# Altium project CONTROLLER.PrjPcb (part 1 of 2)
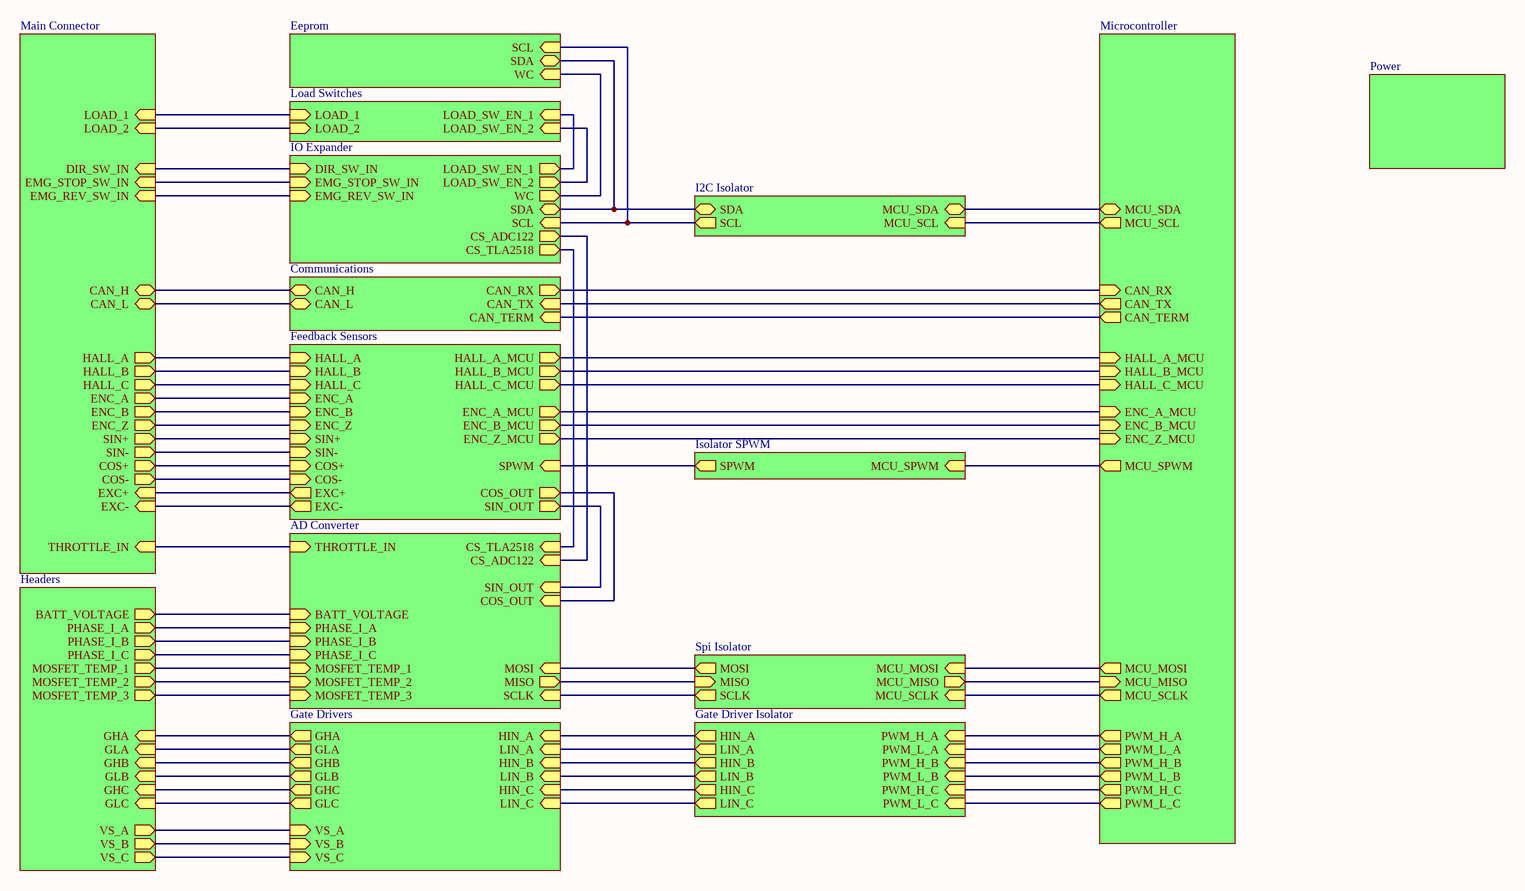
[diagram p0: Interconnections.SchDoc]
16 sheets, 214 parts. Net scope: hierarchical (ports join the sheet entries above them; power ports are global).
Board file: CONTROLLER.PcbDoc
Sheets:
  Interconnections.SchDoc
    Power = Power.SchDoc
    Eeprom = Eeprom.SchDoc
    Load Switches = Load_Switches.SchDoc
    IO Expander = IO_Expander.SchDoc
    Communications = Communications.SchDoc
    Feedback Sensors = Feedback_Sensors.SchDoc
    AD Converter = AD_Converter.SchDoc
    Gate Drivers = Gate_Drivers.SchDoc
    Gate Driver Isolator = Isolator_Gate_Driver.SchDoc
    Headers = Headers.SchDoc
    Main Connector = Main_Connector.SchDoc
    Microcontroller = Microcontroller.SchDoc
    Spi Isolator = Isolator_Spi.SchDoc
    I2C Isolator = Isolator_I2C.SchDoc
    Isolator SPWM = Isolator_SPWM.SchDoc

## Sheet Interconnections.SchDoc
size A3; SheetNumber: 1; SheetTotal: 16

### Sub-sheets
AD Converter = AD_Converter.SchDoc: CS_TLA2518 (in), BATT_VOLTAGE (in), PHASE_I_A (in), PHASE_I_C (in), MOSFET_TEMP_1 (in), MOSFET_TEMP_2 (in), MOSFET_TEMP_3 (in), SIN_OUT (in), COS_OUT (in), CS_ADC122 (in), THROTTLE_IN (in), PHASE_I_B (in), SCLK (in), MISO (out), MOSI (in)
Communications = Communications.SchDoc: CAN_RX (out), CAN_TX (in), CAN_H (bidir), CAN_L (bidir), CAN_TERM (in)
Eeprom = Eeprom.SchDoc: SCL (in), SDA (bidir), WC (in)
Feedback Sensors = Feedback_Sensors.SchDoc: EXC- (out), SPWM (in), EXC+ (out), SIN+ (in), SIN- (in), SIN_OUT (out), COS+ (in), COS- (in), HALL_A (in), HALL_B (in), HALL_C (in), HALL_A_MCU (out), HALL_B_MCU (out), HALL_C_MCU (out), ENC_A (in), ENC_B (in), ENC_A_MCU (out), ENC_B_MCU (out), ENC_Z_MCU (out), ENC_Z (in), COS_OUT (out)
Gate Driver Isolator = Isolator_Gate_Driver.SchDoc: PWM_H_A (in), PWM_L_A (in), PWM_H_B (in), PWM_L_B (in), PWM_H_C (in), PWM_L_C (in), HIN_A (out), LIN_A (out), HIN_B (out), LIN_B (out), HIN_C (out), LIN_C (out)
Gate Drivers = Gate_Drivers.SchDoc: GHA (out), GLA (out), VS_A (in), HIN_A (in), LIN_A (in), GHB (out), GLB (out), VS_B (in), HIN_B (in), LIN_B (in), GHC (out), GLC (out), VS_C (in), HIN_C (in), LIN_C (in)
Headers = Headers.SchDoc: MOSFET_TEMP_3 (out), MOSFET_TEMP_1 (out), PHASE_I_C (out), PHASE_I_A (out), BATT_VOLTAGE (out), MOSFET_TEMP_2 (out), VS_A (out), VS_B (out), VS_C (out), GHA (in), GLA (in), GHB (in), GLB (in), GHC (in), GLC (in), PHASE_I_B (out)
I2C Isolator = Isolator_I2C.SchDoc: MCU_SDA (bidir), MCU_SCL (in), SDA (bidir), SCL (out)
IO Expander = IO_Expander.SchDoc: LOAD_SW_EN_1 (out), LOAD_SW_EN_2 (out), CS_TLA2518 (out), DIR_SW_IN (in), EMG_STOP_SW_IN (in), EMG_REV_SW_IN (in), CS_ADC122 (out), WC (out), SDA (bidir), SCL (in)
Isolator SPWM = Isolator_SPWM.SchDoc: MCU_SPWM (in), SPWM (out)
Load Switches = Load_Switches.SchDoc: LOAD_SW_EN_1 (in), LOAD_1 (in), LOAD_SW_EN_2 (in), LOAD_2 (in)
Main Connector = Main_Connector.SchDoc: LOAD_1 (in), LOAD_2 (in), DIR_SW_IN (in), EMG_STOP_SW_IN (in), EMG_REV_SW_IN (in), THROTTLE_IN (in), CAN_H (bidir), CAN_L (bidir), EXC+ (in), HALL_A (out), HALL_B (out), HALL_C (out), ENC_A (out), ENC_B (out), ENC_Z (out), SIN+ (out), SIN- (out), COS+ (out), COS- (out), EXC- (in)
Microcontroller = Microcontroller.SchDoc: ENC_Z_MCU (in), ENC_B_MCU (in), ENC_A_MCU (in), HALL_C_MCU (in), HALL_B_MCU (in), HALL_A_MCU (in), CAN_TERM (out), CAN_TX (out), CAN_RX (in), MCU_MOSI (out), MCU_MISO (in), MCU_SCLK (out), PWM_H_A (out), PWM_L_A (out), PWM_L_B (out), PWM_L_C (out), PWM_H_B (out), PWM_H_C (out), MCU_SDA (bidir), MCU_SCL (out), MCU_SPWM (out)
Power = Power.SchDoc: no entries
Spi Isolator = Isolator_Spi.SchDoc: MCU_SCLK (in), MCU_MOSI (in), MCU_MISO (out), SCLK (out), MOSI (out), MISO (in)

### Nets
MISO: sheet AD Converter/MISO, sheet Spi Isolator/MISO
MOSI: sheet AD Converter/MOSI, sheet Spi Isolator/MOSI
SCLK: sheet AD Converter/SCLK, sheet Spi Isolator/SCLK
NetC31_1: sheet IO Expander/DIR_SW_IN, sheet Main Connector/DIR_SW_IN
NetC32_1: sheet IO Expander/EMG_STOP_SW_IN, sheet Main Connector/EMG_STOP_SW_IN
NetC33_1: sheet IO Expander/EMG_REV_SW_IN, sheet Main Connector/EMG_REV_SW_IN
NetC38_1: sheet Feedback Sensors/EXC-, sheet Main Connector/EXC-
NetC39_1: sheet Feedback Sensors/SPWM, sheet Isolator SPWM/SPWM
NetC45_1: sheet Feedback Sensors/EXC+, sheet Main Connector/EXC+
NetC53_1: sheet Feedback Sensors/SIN_OUT, sheet AD Converter/SIN_OUT
NetC55_1: sheet Feedback Sensors/COS_OUT, sheet AD Converter/COS_OUT
NetC74_1: sheet Gate Drivers/VS_A, sheet Headers/VS_A
NetC75_1: sheet Gate Drivers/VS_B, sheet Headers/VS_B
NetC76_1: sheet Gate Drivers/VS_C, sheet Headers/VS_C
NetD2_2: sheet Load Switches/LOAD_1, sheet Main Connector/LOAD_1
NetD4_2: sheet Load Switches/LOAD_2, sheet Main Connector/LOAD_2
NetD9_1: sheet Communications/CAN_H, sheet Main Connector/CAN_H
NetD9_2: sheet Communications/CAN_L, sheet Main Connector/CAN_L
NetD12_1: sheet AD Converter/THROTTLE_IN, sheet Main Connector/THROTTLE_IN
NetIC2_5: sheet Eeprom/SDA, sheet IO Expander/SDA, sheet I2C Isolator/SDA
NetIC2_6: sheet Eeprom/SCL, sheet IO Expander/SCL, sheet I2C Isolator/SCL
NetIC2_7: sheet Eeprom/WC, sheet IO Expander/WC
NetIC3_5: sheet Load Switches/LOAD_SW_EN_1, sheet IO Expander/LOAD_SW_EN_1
NetIC3_7: sheet Load Switches/LOAD_SW_EN_2, sheet IO Expander/LOAD_SW_EN_2
NetIC3_8: sheet IO Expander/CS_TLA2518, sheet AD Converter/CS_TLA2518
NetIC3_10: sheet IO Expander/CS_ADC122, sheet AD Converter/CS_ADC122
NetIC4_2: sheet Communications/CAN_RX, sheet Microcontroller/CAN_RX
NetIC4_3: sheet Communications/CAN_TX, sheet Microcontroller/CAN_TX
NetIC6_3: sheet Feedback Sensors/HALL_A, sheet Main Connector/HALL_A
NetIC6_4: sheet Feedback Sensors/HALL_B, sheet Main Connector/HALL_B
NetIC6_5: sheet Feedback Sensors/HALL_C, sheet Main Connector/HALL_C
NetIC6_12: sheet Feedback Sensors/HALL_C_MCU, sheet Microcontroller/HALL_C_MCU
NetIC6_13: sheet Feedback Sensors/HALL_B_MCU, sheet Microcontroller/HALL_B_MCU
NetIC6_14: sheet Feedback Sensors/HALL_A_MCU, sheet Microcontroller/HALL_A_MCU
NetIC8_3: sheet Feedback Sensors/ENC_A, sheet Main Connector/ENC_A
NetIC8_4: sheet Feedback Sensors/ENC_B, sheet Main Connector/ENC_B
NetIC8_5: sheet Feedback Sensors/ENC_Z, sheet Main Connector/ENC_Z
NetIC8_12: sheet Feedback Sensors/ENC_Z_MCU, sheet Microcontroller/ENC_Z_MCU
NetIC8_13: sheet Feedback Sensors/ENC_B_MCU, sheet Microcontroller/ENC_B_MCU
NetIC8_14: sheet Feedback Sensors/ENC_A_MCU, sheet Microcontroller/ENC_A_MCU
NetIC11_1: sheet AD Converter/PHASE_I_A, sheet Headers/PHASE_I_A
NetIC11_2: sheet AD Converter/PHASE_I_B, sheet Headers/PHASE_I_B
NetIC11_3: sheet AD Converter/PHASE_I_C, sheet Headers/PHASE_I_C
NetIC11_4: sheet AD Converter/MOSFET_TEMP_1, sheet Headers/MOSFET_TEMP_1
NetIC11_5: sheet AD Converter/MOSFET_TEMP_2, sheet Headers/MOSFET_TEMP_2
NetIC11_6: sheet AD Converter/MOSFET_TEMP_3, sheet Headers/MOSFET_TEMP_3
NetIC11_16: sheet AD Converter/BATT_VOLTAGE, sheet Headers/BATT_VOLTAGE
NetIC13_1: sheet Gate Drivers/GLA, sheet Headers/GLA
NetIC13_8: sheet Gate Drivers/GHA, sheet Headers/GHA
NetIC13_12: sheet Gate Drivers/HIN_A, sheet Gate Driver Isolator/HIN_A
NetIC13_14: sheet Gate Drivers/LIN_A, sheet Gate Driver Isolator/LIN_A
NetIC14_1: sheet Gate Drivers/GLB, sheet Headers/GLB
NetIC14_8: sheet Gate Drivers/GHB, sheet Headers/GHB
NetIC14_12: sheet Gate Drivers/HIN_B, sheet Gate Driver Isolator/HIN_B
NetIC14_14: sheet Gate Drivers/LIN_B, sheet Gate Driver Isolator/LIN_B
NetIC15_1: sheet Gate Drivers/GLC, sheet Headers/GLC
NetIC15_8: sheet Gate Drivers/GHC, sheet Headers/GHC
NetIC15_12: sheet Gate Drivers/HIN_C, sheet Gate Driver Isolator/HIN_C
NetIC15_14: sheet Gate Drivers/LIN_C, sheet Gate Driver Isolator/LIN_C
NetIC16_2: sheet Gate Driver Isolator/PWM_H_A, sheet Microcontroller/PWM_H_A
NetIC16_3: sheet Gate Driver Isolator/PWM_L_A, sheet Microcontroller/PWM_L_A
NetIC16_4: sheet Gate Driver Isolator/PWM_H_B, sheet Microcontroller/PWM_H_B
NetIC16_5: sheet Gate Driver Isolator/PWM_L_B, sheet Microcontroller/PWM_L_B
NetIC16_6: sheet Gate Driver Isolator/PWM_H_C, sheet Microcontroller/PWM_H_C
NetIC16_7: sheet Gate Driver Isolator/PWM_L_C, sheet Microcontroller/PWM_L_C
NetIC17_15: sheet Microcontroller/MCU_SCL, sheet I2C Isolator/MCU_SCL
NetIC17_16: sheet Microcontroller/MCU_SDA, sheet I2C Isolator/MCU_SDA
NetIC17_17: sheet Communications/CAN_TERM, sheet Microcontroller/CAN_TERM
NetIC17_45: sheet Microcontroller/MCU_SPWM, sheet Isolator SPWM/MCU_SPWM
NetIC17_46: sheet Microcontroller/MCU_SCLK, sheet Spi Isolator/MCU_SCLK
NetIC17_49: sheet Microcontroller/MCU_MISO, sheet Spi Isolator/MCU_MISO
NetIC17_50: sheet Microcontroller/MCU_MOSI, sheet Spi Isolator/MCU_MOSI
NetJ5_28: sheet Feedback Sensors/SIN+, sheet Main Connector/SIN+
NetJ5_29: sheet Feedback Sensors/SIN-, sheet Main Connector/SIN-
NetJ5_30: sheet Feedback Sensors/COS+, sheet Main Connector/COS+
NetJ5_31: sheet Feedback Sensors/COS-, sheet Main Connector/COS-

## Sheet Power.SchDoc
size A3; SheetNumber: 2; SheetTotal: 16
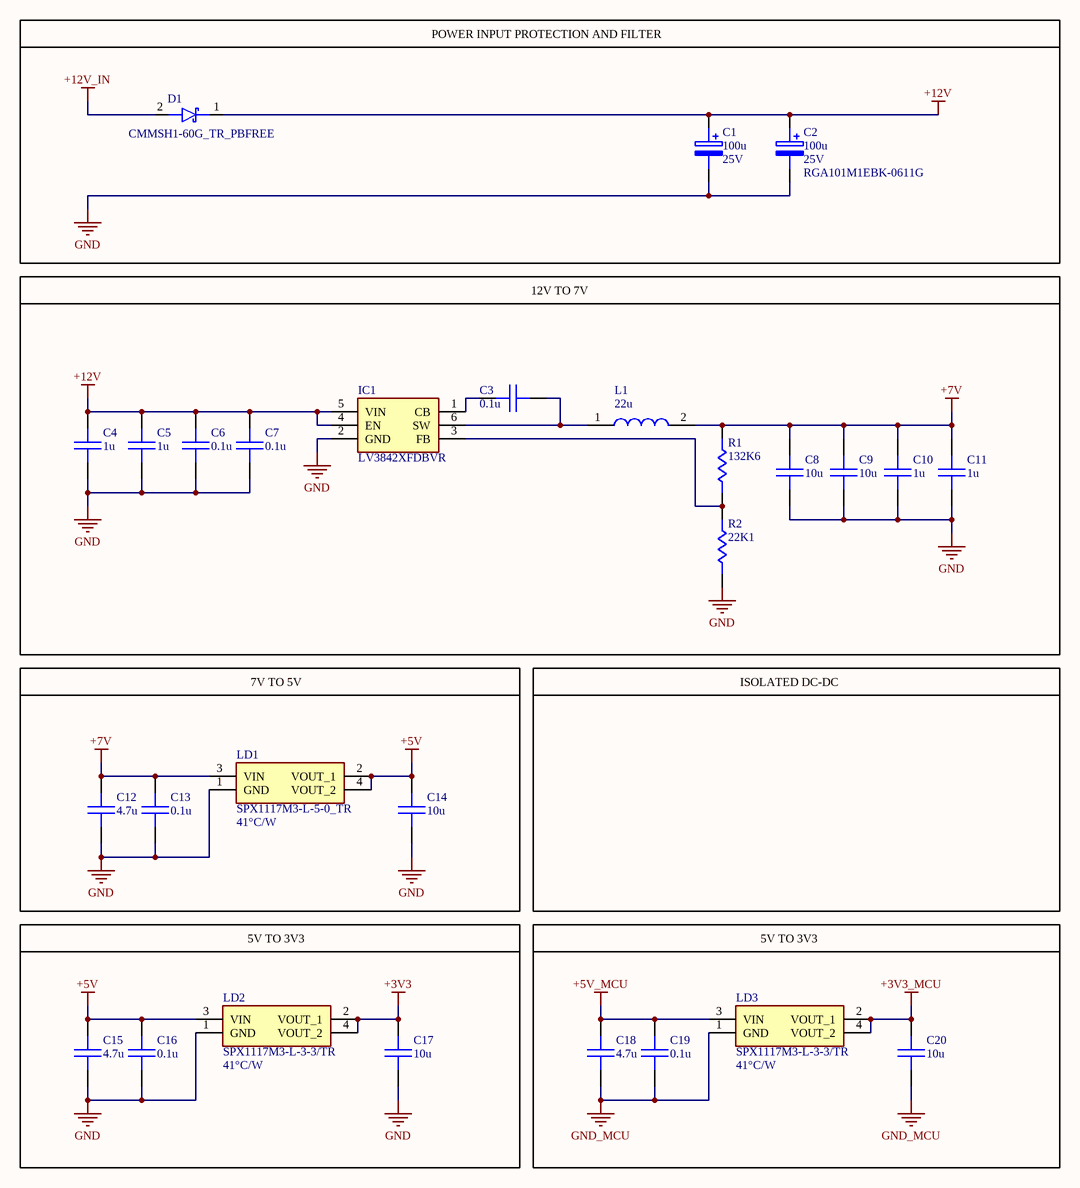
[diagram p1: Power.SchDoc]

### Parts
C1  value 100u  Voltage: 25V  [C_THT_6.3X11X2.5]  (hidden comment: RGA101M1EBK-0611G)
C2  RGA101M1EBK-0611G  value 100u  Voltage: 25V  [C_THT_6.3X11X2.5]
C3  0.1u  [C_0603]
C4  1u  [C_0805]
C5  1u  [C_0805]
C6  0.1u  [C_0603]
C7  0.1u  [C_0603]
C8  10u  [C_1206]
C9  10u  [C_1206]
C10  1u  [C_0805]
C11  1u  [C_0805]
C12  4.7u  [C_0805]
C13  0.1u  [C_0603]
C14  10u  [C_1206]
C15  4.7u  [C_0805]
C16  0.1u  [C_0603]
C17  10u  [C_1206]
C18  4.7u  [C_0805]
C19  0.1u  [C_0603]
C20  10u  [C_1206]
D1  CMMSH1-60G_TR_PBFREE  [SOD-123-2]
IC1  LV3842XFDBVR  [SOT23-6]
L1  22u  [IND_5x5x4.5]
LD1  SPX1117M3-L-5-0_TR  Junction to Ambient: 41°C/W  [SOT223-3]
LD2  SPX1117M3-L-3-3/TR  Junction to Ambient: 41°C/W  [SOT223-3]
LD3  SPX1117M3-L-3-3/TR  Junction to Ambient: 41°C/W  [SOT223-3]
R1  132K6  [R_0603]
R2  22K1  [R_0603]

### Blocks framed on the sheet
POWER INPUT PROTECTION AND FILTER: C1 C2 D1
12V TO 7V: C3-C11 IC1 L1 R1 R2
7V TO 5V: C12-C14 LD1
5V TO 3V3: C15-C17 LD2
5V TO 3V3: C18-C20 LD3

### Nets
+3V3: C17.1 LD2.2(VOUT_1) LD2.4(VOUT_2)
+3V3_MCU: C20.1 LD3.2(VOUT_1) LD3.4(VOUT_2)
+5V: C14.1 C15.1 C16.1 LD1.2(VOUT_1) LD1.4(VOUT_2) LD2.3(VIN)
+5V_MCU: C18.1 C19.1 LD3.3(VIN)
+7V: C8.1 C9.1 C10.1 C11.1 C12.1 C13.1 L1.2 LD1.3(VIN) R1.2
+12V: C1.1(+) C2.1(+) C4.1 C5.1 C6.2 C7.2 D1.1(K) IC1.4(EN) IC1.5(VIN)
+12V_IN: D1.2(A)
GND: C1.2(-) C2.2(-) C4.2 C5.2 C6.1 C7.1 C8.2 C9.2 C10.2 C11.2 C12.2 C13.2 C14.2 C15.2 C16.2 C17.2 IC1.2(GND) LD1.1(GND) LD2.1(GND) R2.1
GND_MCU: C18.2 C19.2 C20.2 LD3.1(GND)
NetC3_1: C3.1 IC1.6(SW) L1.1
NetC3_2: C3.2 IC1.1(CB)
NetIC1_3: IC1.3(FB) R1.1 R2.2

### Notes on the sheet
- ISOLATED DC-DC

### Library data of the parts
C1 C2 = CAP_POL_THT_100u_25V: Aluminium Electrolytic Capacitors - Radial Leaded 25V 100uF 105C 6.3x11mm; ComponentLink1Description: Link; ComponentLink1URL: https://www.mouser.com.tr/ProductDetail/Lelon/RGA101M1EBK-0611G?qs=sGAEpiMZZMvwFf0viD3Y3ZPeeWspSkPKwMATVGPRbS8%3D
C3-C20 = CAP: SMD Chip Capacitor
D1 = DIODE_SCHOTTKY_CMMSH1-60G_TR_PBFREE: Schottky Diodes & Rectifiers; Vrm: 60V; If: 1A; Vf: 0.85A; ComponentLink1Description: New link; ComponentLink1URL: https://www.mouser.com.tr/ProductDetail/Central-Semiconductor/CMMSH1-60G-TR-PBFREE?qs=u16ybLDytRaqwQ9Jtbd3vg%3D%3D
IC1 = DC_DC_LV3842XFDBVR: Switching Voltage Regulators 4-V to 36-V 600-mA synchronous step-dow (FPWM)
L1 = INDUCTOR: VLS5045EX-220M
LD1 = LDO_SPX1117M3-L-5-0_TR: LDO Voltage Regulators, 800mA, 5V Fixed Output; Vinmax: 15V; Dropout Voltage: 1.1V; ComponentLink1Description: Link; ComponentLink1URL: https://www.mouser.com.tr/ProductDetail/MaxLinear/SPX1117M3-L-5-0-TR?qs=sGAEpiMZZMuLLNXTG1MZamssjbYkpgRd0ulvD9ADRVk%3D
LD2 LD3 = LDO_SPX1117M3-L-3-3/TR: LDO Voltage Regulators, 800mA, 3.3V Fixed Output; Vinmax: 15V; Dropout Voltage: 1.1V; ComponentLink1Description: Link; ComponentLink1URL: https://www.mouser.com.tr/ProductDetail/MaxLinear/SPX1117M3-L-3-3-TR?qs=S%2FCBhQS5rCofor8XCFP4ag%3D%3D
R1 R2 = RES: SMD Chip Resistor

## Sheet Eeprom.SchDoc
size A4; SheetNumber: 3; SheetTotal: 16
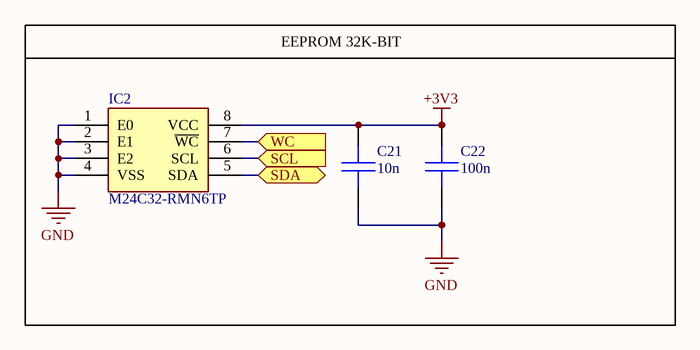
[diagram p2: Eeprom.SchDoc]

### Parts
C21  10n  [C_0603]
C22  100n  [C_0603]
IC2  M24C32-RMN6TP  [SOIC127P600X175-8N]

### Blocks framed on the sheet
EEPROM 32K-BIT: C21 C22 IC2

### Ports
SCL (in, see Interconnections[3A], IO_Expander[2A], Isolator_I2C[2A]), SDA (bidir, see Interconnections[3A], IO_Expander[2A], Isolator_I2C[2A]), WC (in, see Interconnections[3A], IO_Expander[3A])

### Nets
+3V3: C21.1 C22.1 IC2.8(VCC)
GND: C21.2 C22.2 IC2.1(E0) IC2.2(E1) IC2.3(E2) IC2.4(VSS)
NetIC2_5: IC2.5(SDA) ; port SDA
NetIC2_6: IC2.6(SCL) ; port SCL
NetIC2_7: IC2.7(~{WC}) ; port WC

### Library data of the parts
C21 C22 = CAP: SMD Chip Capacitor
IC2 = M24C32-RMN6TP: Integrated Circuit; Manufacturer_Name: STMicroelectronics; Datasheet Link: http://www.st.com/content/ccc/resource/technical/document/datasheet/80/4e/8c/54/f2/63/4c/4a/CD00001012.pdf/files/CD00001012.pdf/jcr:content/translations/en.CD00001012.pdf; Height: 1.75mm; Manufacturer_Part_Number: M24C32-RMN6TP; Mouser Part Number: 511-M24C32-RMN6TP; Mouser Price/Stock: https://www.mouser.co.uk/ProductDetail/STMicroelectronics/M24C32-RMN6TP?qs=mxjAf%2Fzt%2FiCvN2%252BVDNbw9w%3D%3D; Arrow Part Number: M24C32-RMN6TP; Arrow Price/Stock: https://www.arrow.com/en/products/m24c32-rmn6tp/stmicroelectronics?region=nac

## Sheet Load_Switches.SchDoc
size A3; SheetNumber: 4; SheetTotal: 16
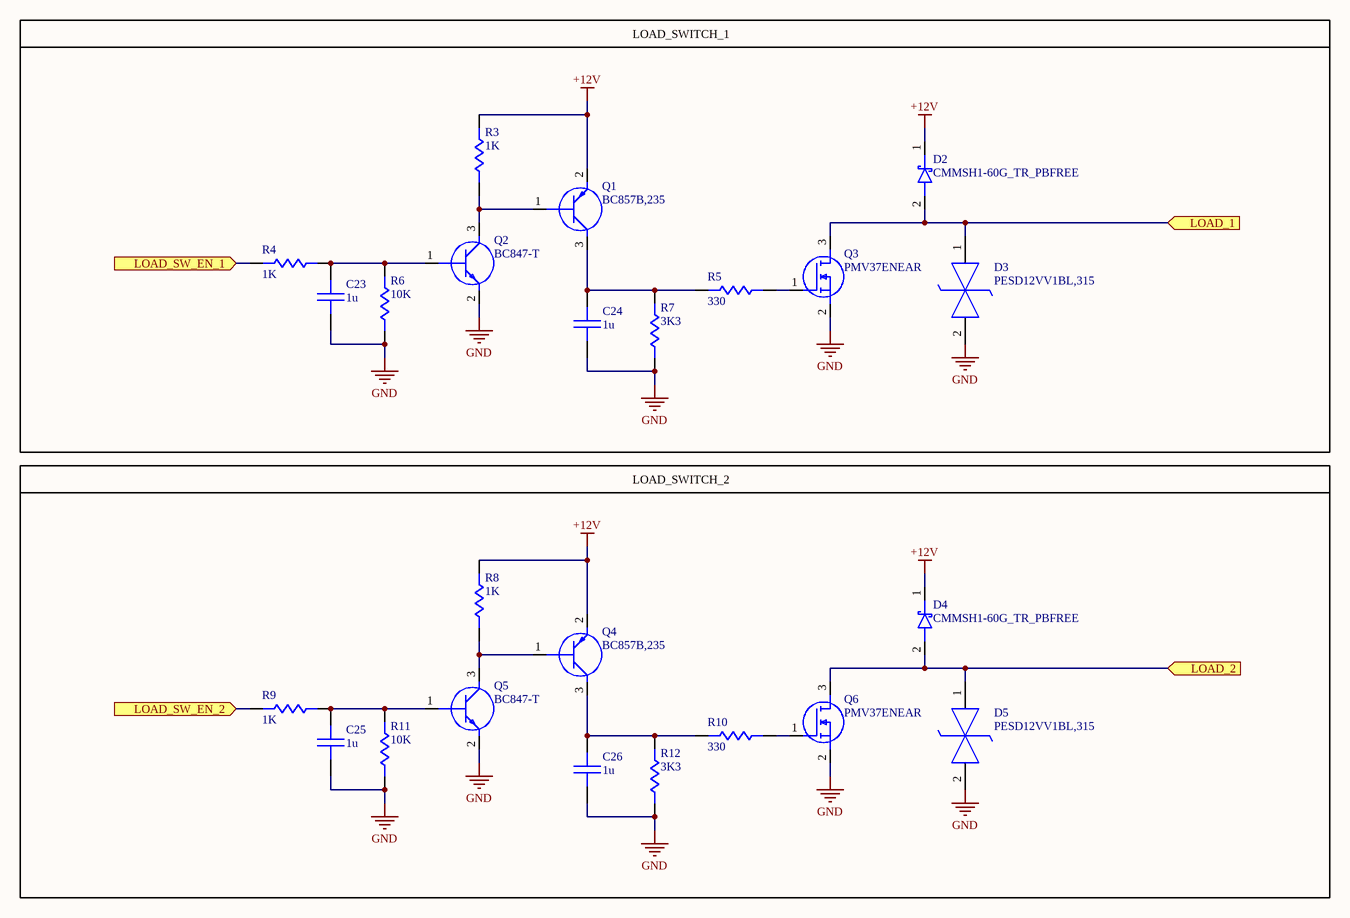
[diagram p3: Load_Switches.SchDoc]

### Parts
C23  1u  [C_0603]
C24  1u  [C_0603]
C25  1u  [C_0603]
C26  1u  [C_0603]
D2  CMMSH1-60G_TR_PBFREE  [SOD-123-2]
D3  PESD12VV1BL,315  [PESD5V0S1BL315]
D4  CMMSH1-60G_TR_PBFREE  [SOD-123-2]
D5  PESD12VV1BL,315  [PESD5V0S1BL315]
Q1  BC857B,235  [SOT95P230X110-3N]
Q2  BC847-T  [SOT95P240X115-3N]
Q3  PMV37ENEAR  [SOT95P230X110-3N]
Q4  BC857B,235  [SOT95P230X110-3N]
Q5  BC847-T  [SOT95P240X115-3N]
Q6  PMV37ENEAR  [SOT95P230X110-3N]
R3  1K  [R_0603]
R4  1K  [R_0603]
R5  330  [R_0603]
R6  10K  [R_0603]
R7  3K3  [R_0603]
R8  1K  [R_0603]
R9  1K  [R_0603]
R10  330  [R_0603]
R11  10K  [R_0603]
R12  3K3  [R_0603]

### Blocks framed on the sheet
LOAD_SWITCH_1: C23 C24 D2 D3 Q1-Q3 R3-R7
LOAD_SWITCH_2: C25 C26 D4 D5 Q4-Q6 R8-R12

### Ports
LOAD_1 (in, see Interconnections[2A], Main_Connector[1B]), LOAD_2 (in, see Interconnections[2A], Main_Connector[1B]), LOAD_SW_EN_1 (in, see Interconnections[3A], IO_Expander[3A]), LOAD_SW_EN_2 (in, see Interconnections[3A], IO_Expander[3A])

### Nets
+12V: D2.1(K) D4.1(K) Q1.2(E) Q4.2(E) R3.1 R8.1
GND: C23.2 C24.2 C25.2 C26.2 D3.2(K2) D5.2(K2) Q2.2(E) Q3.2(S) Q5.2(E) Q6.2(S) R6.2 R7.2 R11.2 R12.2
NetC23_1: C23.1 Q2.1(B) R4.2 R6.1
NetC24_1: C24.1 Q1.3(C) R5.2 R7.1
NetC25_1: C25.1 Q5.1(B) R9.2 R11.1
NetC26_1: C26.1 Q4.3(C) R10.2 R12.1
NetD2_2: D2.2(A) D3.1(K1) Q3.3(D) ; port LOAD_1
NetD4_2: D4.2(A) D5.1(K1) Q6.3(D) ; port LOAD_2
NetIC3_5: R4.1 ; port LOAD_SW_EN_1
NetIC3_7: R9.1 ; port LOAD_SW_EN_2
NetQ1_1: Q1.1(B) Q2.3(C) R3.2
NetQ3_1: Q3.1(G) R5.1
NetQ4_1: Q4.1(B) Q5.3(C) R8.2
NetQ6_1: Q6.1(G) R10.1

### Library data of the parts
C23-C26 = CAP: SMD Chip Capacitor
D2 D4 = DIODE_SCHOTTKY_CMMSH1-60G_TR_PBFREE: as D1 on sheet Power; ComponentLink1Description: New link; ComponentLink1URL: https://www.mouser.com.tr/ProductDetail/Central-Semiconductor/CMMSH1-60G-TR-PBFREE?qs=u16ybLDytRaqwQ9Jtbd3vg%3D%3D
D3 D5 = PESD12VV1BL,315: Diode ESD (Bi-directional); Manufacturer_Name: Nexperia; Datasheet Link: https://assets.nexperia.com/documents/data-sheet/PESD12VV1BL.pdf; Height: 0mm; Manufacturer_Part_Number: PESD12VV1BL,315; Mouser Part Number: 771-PESD12VV1BL,315; Mouser Price/Stock: https://www.mouser.co.uk/ProductDetail/Nexperia/PESD12VV1BL315?qs=zHGtguZFFhIuyro4byE1mg%3D%3D; Arrow Part Number: PESD12VV1BL,315; Arrow Price/Stock: https://www.arrow.com/en/products/pesd12vv1bl315/nexperia?region=nac
Q1 Q4 = BC857B,235: Transistor BJT PNP; Manufacturer_Name: Nexperia; Datasheet Link: https://assets.nexperia.com/documents/data-sheet/BC856_BC857_BC858.pdf; Height: 1.1mm; Manufacturer_Part_Number: BC857B,235; Mouser Part Number: 771-BC857B235; Mouser Price/Stock: https://www.mouser.co.uk/ProductDetail/Nexperia/BC857B235?qs=me8TqzrmIYWSnmooO7Bp2g%3D%3D; Arrow Part Number: BC857B,235; Arrow Price/Stock: https://www.arrow.com/en/products/bc857b235/nexperia?region=europe
Q2 Q5 = BC847-T: Transistor BJT NPN; Manufacturer_Name: Rectron; Datasheet Link: https://www.rectron.com/public/product_datasheets/bc846-bc848.pdf; Height: 1.15mm; Manufacturer_Part_Number: BC847-T; Mouser Part Number: 583-BC847; Mouser Price/Stock: https://www.mouser.co.uk/ProductDetail/Rectron/BC847-T?qs=88VD4TDCwKCxjiqyDdAfrw%3D%3D
Q3 Q6 = PMV37ENEAR: MOSFET (N-Channel); Manufacturer_Name: Nexperia; Datasheet Link: https://assets.nexperia.com/documents/data-sheet/PMV37ENEA.pdf; Height: 1.1mm; Manufacturer_Part_Number: PMV37ENEAR; Mouser Part Number: 771-PMV37ENEAR; Mouser Price/Stock: https://www.mouser.co.uk/ProductDetail/Nexperia/PMV37ENEAR?qs=T3oQrply3y%2Frl%252BtsBfD26A%3D%3D; Arrow Part Number: PMV37ENEAR; Arrow Price/Stock: https://www.arrow.com/en/products/pmv37enear/nexperia?region=nac
R3-R12 = RES: SMD Chip Resistor

## Sheet IO_Expander.SchDoc
size A3; SheetNumber: 5; SheetTotal: 16
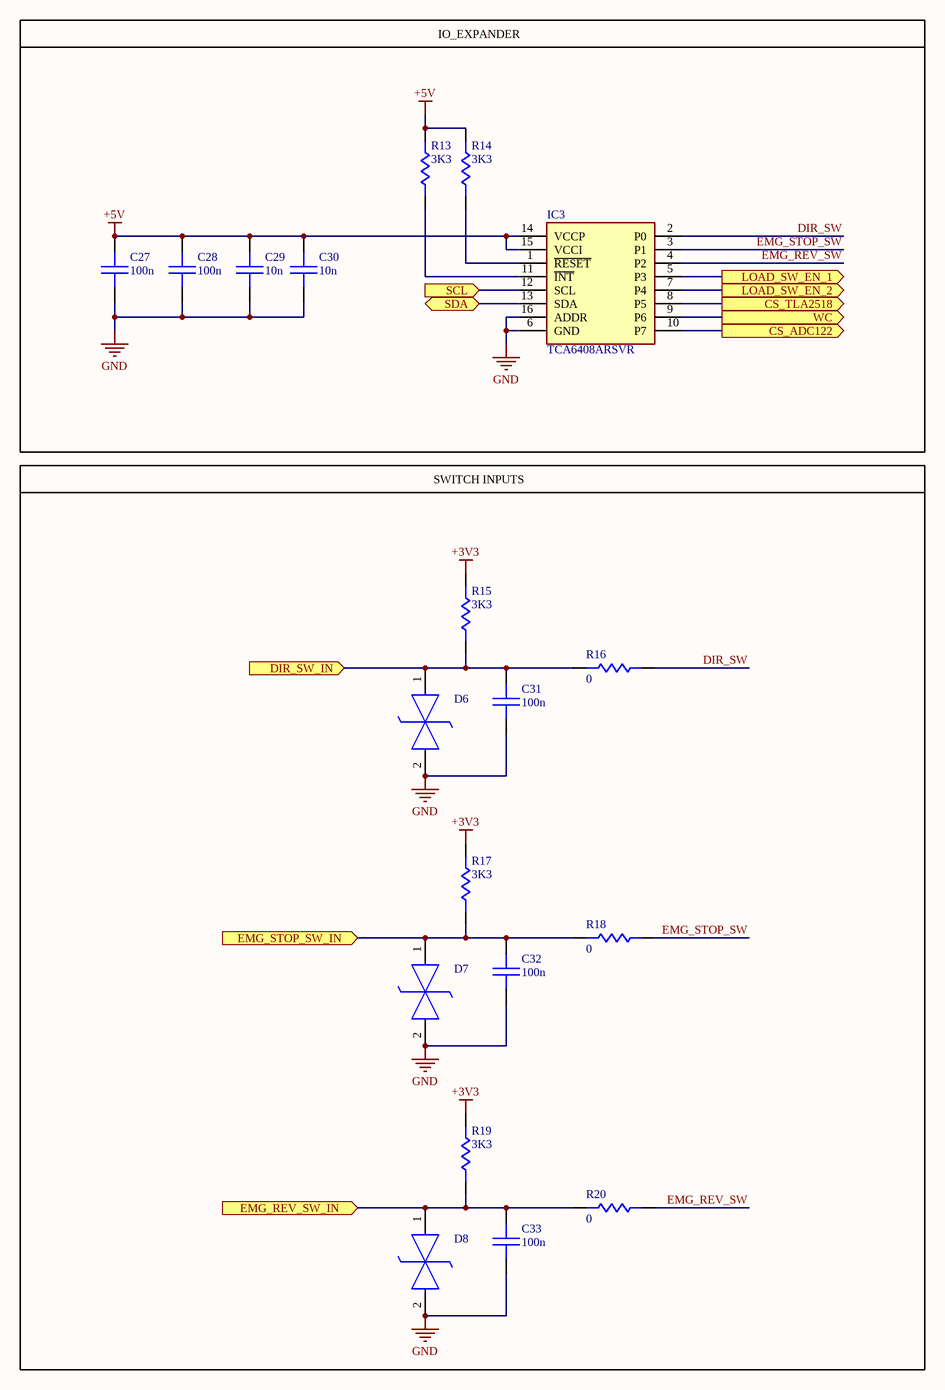
[diagram p4: IO_Expander.SchDoc]

### Parts
C27  100n  [C_0603]
C28  100n  [C_0603]
C29  10n  [C_0603]
C30  10n  [C_0603]
C31  100n  [C_0603]
C32  100n  [C_0603]
C33  100n  [C_0603]
D6  PESD3V3Y1BSFYL  [PMEG3005AESFYL]  (value not drawn)
D7  PESD3V3Y1BSFYL  [PMEG3005AESFYL]  (value not drawn)
D8  PESD3V3Y1BSFYL  [PMEG3005AESFYL]  (value not drawn)
IC3  TCA6408ARSVR  [QFN40P180X260X55-16N]
R13  3K3  [R_0603]
R14  3K3  [R_0603]
R15  3K3  [R_0603]
R16  0  [R_0603]
R17  3K3  [R_0603]
R18  0  [R_0603]
R19  3K3  [R_0603]
R20  0  [R_0603]

### Blocks framed on the sheet
IO_EXPANDER: C27-C30 IC3 R13 R14
SWITCH INPUTS: C31-C33 D6-D8 R15-R20

### Ports
CS_ADC122 (out, see Interconnections[3A], AD_Converter[3B]), CS_TLA2518 (out, see Interconnections[3A], AD_Converter[2A]), DIR_SW_IN (in, see Interconnections[2A], Main_Connector[1B]), EMG_REV_SW_IN (in, see Interconnections[2A], Main_Connector[1B]), EMG_STOP_SW_IN (in, see Interconnections[2A], Main_Connector[1B]), LOAD_SW_EN_1 (out, see Interconnections[3A], Load_Switches[1A]), LOAD_SW_EN_2 (out, see Interconnections[3A], Load_Switches[1B]), SCL (in, see Interconnections[3A], Eeprom[1A], Isolator_I2C[2A]), SDA (bidir, see Interconnections[3A], Eeprom[1A], Isolator_I2C[2A]), WC (out, see Interconnections[3A], Eeprom[1A])

### Nets
+3V3: R15.2 R17.2 R19.2
+5V: C27.1 C28.1 C29.1 C30.1 IC3.14(VCCP) IC3.15(VCCI) R13.2 R14.2
GND: C27.2 C28.2 C29.2 C30.2 C31.2 C32.2 C33.2 D6.2(K2) D7.2(K2) D8.2(K2) IC3.6(GND) IC3.16(ADDR)
DIR_SW: IC3.2(P0) R16.1
EMG_REV_SW: IC3.4(P2) R20.1
EMG_STOP_SW: IC3.3(P1) R18.1
NetC31_1: C31.1 D6.1(K1) R15.1 R16.2 ; port DIR_SW_IN
NetC32_1: C32.1 D7.1(K1) R17.1 R18.2 ; port EMG_STOP_SW_IN
NetC33_1: C33.1 D8.1(K1) R19.1 R20.2 ; port EMG_REV_SW_IN
NetIC2_5: IC3.13(SDA) ; port SDA
NetIC2_6: IC3.12(SCL) ; port SCL
NetIC2_7: IC3.9(P6) ; port WC
NetIC3_1: IC3.1(~{RESET}) R14.1
NetIC3_5: IC3.5(P3) ; port LOAD_SW_EN_1
NetIC3_7: IC3.7(P4) ; port LOAD_SW_EN_2
NetIC3_8: IC3.8(P5) ; port CS_TLA2518
NetIC3_10: IC3.10(P7) ; port CS_ADC122
NetIC3_11: IC3.11(~{INT}) R13.1

### Library data of the parts
C27-C33 = CAP: SMD Chip Capacitor
D6-D8 = PESD3V3Y1BSFYL: Diode ESD (Bi-directional); Manufacturer_Name: Nexperia; Datasheet Link: https://assets.nexperia.com/documents/data-sheet/PESD3V3Y1BSF.pdf; Manufacturer_Part_Number: PESD3V3Y1BSFYL; Mouser Part Number: 771-PESD3V3Y1BSFYL; Mouser Price/Stock: https://www.mouser.co.uk/ProductDetail/Nexperia/PESD3V3Y1BSFYL?qs=MLItCLRbWswJ%2F2jJIhlIxQ%3D%3D; Arrow Part Number: PESD3V3Y1BSFYL; Arrow Price/Stock: https://www.arrow.com/en/products/pesd3v3y1bsfyl/nexperia?region=asia
IC3 = TCA6408ARSVR: Integrated Circuit; Manufacturer_Name: Texas Instruments; Datasheet Link: http://www.ti.com/lit/gpn/tca6408a; Height: 0.55mm; Manufacturer_Part_Number: TCA6408ARSVR; Mouser Part Number: 595-TCA6408ARSVR; Mouser Price/Stock: https://www.mouser.co.uk/ProductDetail/Texas-Instruments/TCA6408ARSVR?qs=AFkNxQkJKAISZm6jGsM%252BSQ%3D%3D; Arrow Part Number: TCA6408ARSVR; Arrow Price/Stock: https://www.arrow.com/en/products/tca6408arsvr/texas-instruments?region=nac
R13-R20 = RES: SMD Chip Resistor

## Sheet Communications.SchDoc
size A4; SheetNumber: 6; SheetTotal: 16
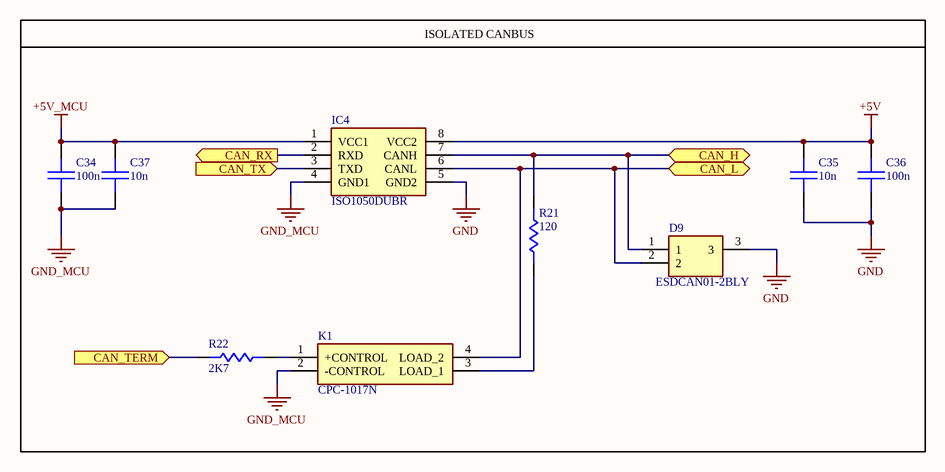
[diagram p5: Communications.SchDoc]

### Parts
C34  100n  [C_0603]
C35  10n  [C_0603]
C36  100n  [C_0603]
C37  10n  [C_0603]
D9  ESDCAN01-2BLY  [SOT95P255X125-3N]
IC4  ISO1050DUBR  [SOP254P1040X485-8N]
K1  CPC-1017N  [SOP254P610X206-4N]
R21  120  [R_0603]
R22  2K7  [R_0603]

### Blocks framed on the sheet
ISOLATED CANBUS: C34-C37 D9 IC4 K1 R21 R22

### Ports
CAN_H (bidir, see Interconnections[2B], Main_Connector[1B]), CAN_L (bidir, see Interconnections[2B], Main_Connector[1B]), CAN_RX (out, see Interconnections[3B], Microcontroller[4A]), CAN_TERM (in, see Interconnections[3B], Microcontroller[4A]), CAN_TX (in, see Interconnections[3B], Microcontroller[4A])

### Nets
+5V: C35.1 C36.1 IC4.8(VCC2)
+5V_MCU: C34.2 C37.1 IC4.1(VCC1)
GND: C35.2 C36.2 D9.3 IC4.5(GND2)
GND_MCU: C34.1 C37.2 IC4.4(GND1) K1.2(-CONTROL)
NetD9_1: D9.1 IC4.7(CANH) R21.2 ; port CAN_H
NetD9_2: D9.2 IC4.6(CANL) K1.4(LOAD_2) ; port CAN_L
NetIC4_2: IC4.2(RXD) ; port CAN_RX
NetIC4_3: IC4.3(TXD) ; port CAN_TX
NetIC17_17: R22.2 ; port CAN_TERM
NetK1_1: K1.1(+CONTROL) R22.1
NetK1_3: K1.3(LOAD_1) R21.1

### Library data of the parts
C34-C37 = CAP: SMD Chip Capacitor
D9 = ESDCAN01-2BLY: TVS Diode (Bi-directional); Manufacturer_Name: STMicroelectronics; Datasheet Link: https://componentsearchengine.com/Datasheets/2/ESDCAN01-2BLY.pdf; Height: 1.25mm; Manufacturer_Part_Number: ESDCAN01-2BLY; Mouser Part Number: 511-ESDCAN01-2BLY; Mouser Price/Stock: https://www.mouser.co.uk/ProductDetail/STMicroelectronics/ESDCAN01-2BLY?qs=Ok1pvOkw6%2FpNzC2RQnWwPA%3D%3D; Arrow Part Number: ESDCAN01-2BLY; Arrow Price/Stock: https://www.arrow.com/en/products/esdcan01-2bly/stmicroelectronics?region=nac
IC4 = ISO1050DUBR: Integrated Circuit; Manufacturer_Name: Texas Instruments; Datasheet Link: http://www.ti.com/lit/ds/symlink/iso1050.pdf; Height: 4.85mm; Manufacturer_Part_Number: ISO1050DUBR; Mouser Part Number: 595-ISO1050DUBR; Mouser Price/Stock: https://www.mouser.co.uk/ProductDetail/Texas-Instruments/ISO1050DUBR?qs=IK5e5L0zOXhhp9hdAolE%252BA%3D%3D; Arrow Part Number: ISO1050DUBR; Arrow Price/Stock: https://www.arrow.com/en/products/iso1050dubr/texas-instruments?region=europe
K1 = CPC-1017N: Relay or Contactor; Manufacturer_Name: LITTELFUSE; Datasheet Link: http://www.ixysic.com/home/pdfs.nsf/www/CPC1017N.pdf/$file/CPC1017N.pdf; Height: 2.055mm; Manufacturer_Part_Number: CPC-1017N
R21 R22 = RES: SMD Chip Resistor

## Sheet Feedback_Sensors.SchDoc
size A2; SheetNumber: 7; SheetTotal: 16
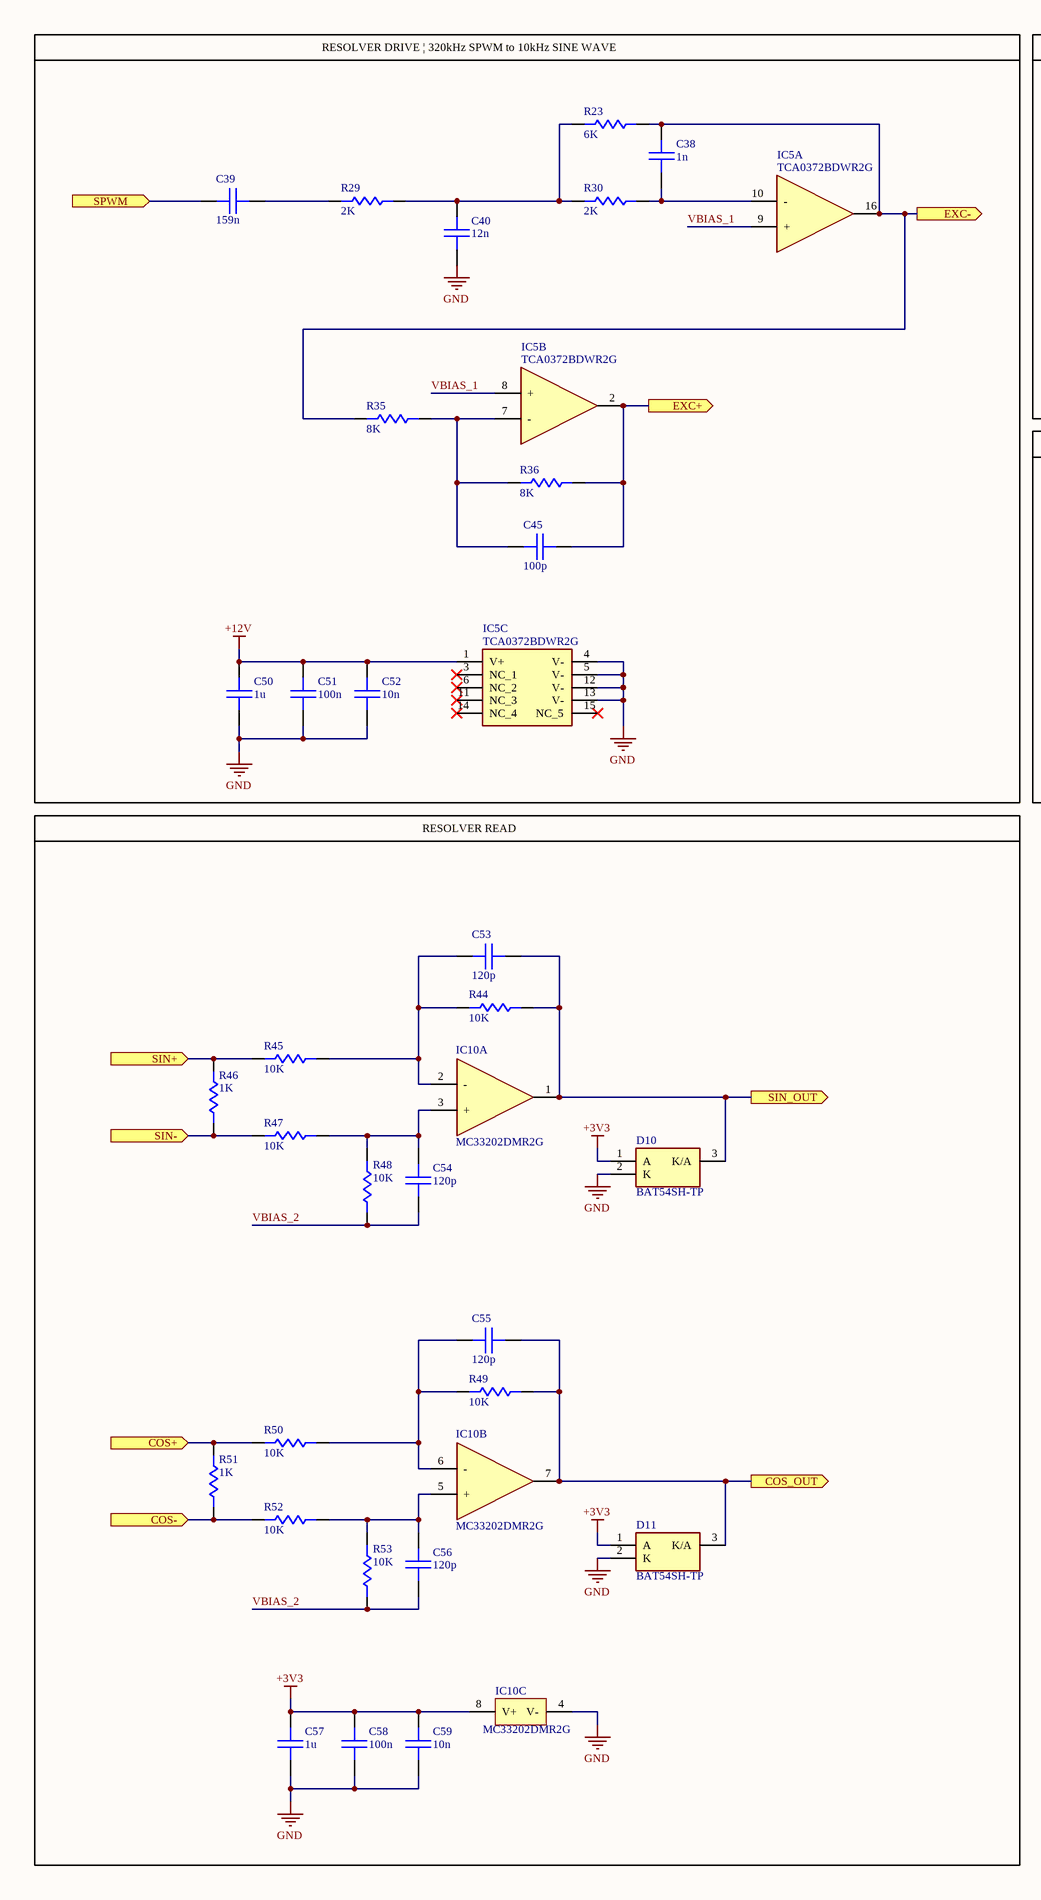
[diagram p6: Feedback_Sensors.SchDoc, left]
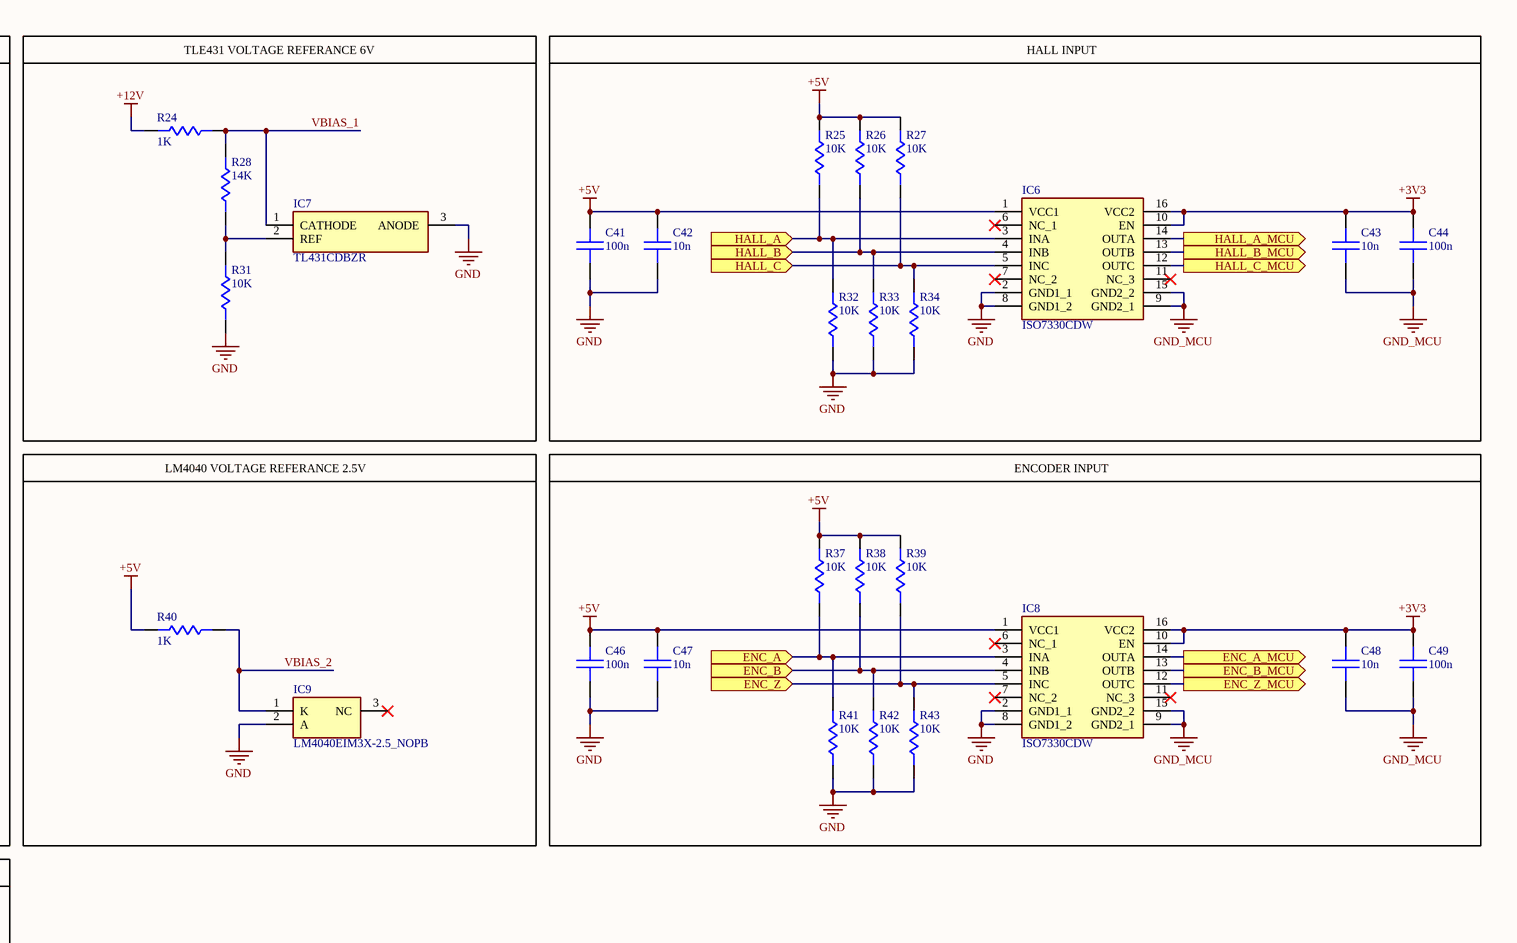
[diagram p7: Feedback_Sensors.SchDoc, right]

### Parts
C38  1n  [C_0603]
C39  159n  [C_0603]
C40  12n  [C_0603]
C41  100n  [C_0603]
C42  10n  [C_0603]
C43  10n  [C_0603]
C44  100n  [C_0603]
C45  100p  [C_0603]
C46  100n  [C_0603]
C47  10n  [C_0603]
C48  10n  [C_0603]
C49  100n  [C_0603]
C50  1u  [C_0603]
C51  100n  [C_0603]
C52  10n  [C_0603]
C53  120p  [C_0603]
C54  120p  [C_0603]
C55  120p  [C_0603]
C56  120p  [C_0603]
C57  1u  [C_0603]
C58  100n  [C_0603]
C59  10n  [C_0603]
D10  BAT54SH-TP  [SOT95P237X125-3N]
D11  BAT54SH-TP  [SOT95P237X125-3N]
IC5  TCA0372BDWR2G  [SOIC127P1030X265-16N]  (parts A,B,C of 3)
IC6  ISO7330CDW  [SOIC127P1030X265-16N]
IC7  TL431CDBZR  [SOT95P237X112-3N]
IC8  ISO7330CDW  [SOIC127P1030X265-16N]
IC9  LM4040EIM3X-2.5_NOPB  [SOT95P237X112-3N]
IC10  MC33202DMR2G  [SOP65P490X110-8N]  (parts A,B,C of 3)
R23  6K  [R_0603]
R24  1K  [R_0603]
R25  10K  [R_0603]
R26  10K  [R_0603]
R27  10K  [R_0603]
R28  14K  [R_0603]
R29  2K  [R_0603]
R30  2K  [R_0603]
R31  10K  [R_0603]
R32  10K  [R_0603]
R33  10K  [R_0603]
R34  10K  [R_0603]
R35  8K  [R_0603]
R36  8K  [R_0603]
R37  10K  [R_0603]
R38  10K  [R_0603]
R39  10K  [R_0603]
R40  1K  [R_0603]
R41  10K  [R_0603]
R42  10K  [R_0603]
R43  10K  [R_0603]
R44  10K  [R_0603]
R45  10K  [R_0603]
R46  1K  [R_0603]
R47  10K  [R_0603]
R48  10K  [R_0603]
R49  10K  [R_0603]
R50  10K  [R_0603]
R51  1K  [R_0603]
R52  10K  [R_0603]
R53  10K  [R_0603]

### Blocks framed on the sheet
RESOLVER DRIVE | 320kHz SPWM to 10kHz SINE WAVE: C38-C40 C45 C50-C52 IC5 R23 R29 R30 R35 R36
TLE431 VOLTAGE REFERANCE 6V: IC7 R24 R28 R31
HALL INPUT: C41-C44 IC6 R25-R27 R32-R34
LM4040 VOLTAGE REFERANCE 2.5V: IC9 R40
ENCODER INPUT: C46-C49 IC8 R37-R39 R41-R43
RESOLVER READ: C53-C59 D10 D11 IC10 R44-R53

### Ports
COS+ (in, see Interconnections[2B], Main_Connector[2B]), COS- (in, see Interconnections[2B], Main_Connector[2B]), COS_OUT (out, see Interconnections[3B], AD_Converter[2C]), ENC_A (in, see Interconnections[2B], Main_Connector[2B]), ENC_A_MCU (out, see Interconnections[3B], Microcontroller[4B]), ENC_B (in, see Interconnections[2B], Main_Connector[2B]), ENC_B_MCU (out, see Interconnections[3B], Microcontroller[4B]), ENC_Z (in, see Interconnections[2B], Main_Connector[2B]), ENC_Z_MCU (out, see Interconnections[3B], Microcontroller[4B]), EXC+ (out, see Interconnections[2B], Main_Connector[2B]), EXC- (out, see Interconnections[2B], Main_Connector[2B]), HALL_A (in, see Interconnections[2B], Main_Connector[2A]), HALL_A_MCU (out, see Interconnections[3B], Microcontroller[4A]), HALL_B (in, see Interconnections[2B], Main_Connector[2A]), HALL_B_MCU (out, see Interconnections[3B], Microcontroller[4B]), HALL_C (in, see Interconnections[2B], Main_Connector[2B]), HALL_C_MCU (out, see Interconnections[3B], Microcontroller[4B]), SIN+ (in, see Interconnections[2B], Main_Connector[2B]), SIN- (in, see Interconnections[2B], Main_Connector[2B]), SIN_OUT (out, see Interconnections[3B], AD_Converter[2B]), SPWM (in, see Interconnections[3B], Isolator_SPWM[2A])

### Nets
+3V3: C43.2 C44.2 C48.2 C49.2 C57.2 C58.2 C59.2 D10.1(A) D11.1(A) IC6.10(EN) IC6.16(VCC2) IC8.10(EN) IC8.16(VCC2) IC10.8(V+)
+5V: C41.2 C42.2 C46.2 C47.2 IC6.1(VCC1) IC8.1(VCC1) R25.1 R26.1 R27.1 R37.1 R38.1 R39.1 R40.2
+12V: C50.2 C51.2 C52.2 IC5.1(V+) R24.2
GND: C40.2 C41.1 C42.1 C46.1 C47.1 C50.1 C51.1 C52.1 C57.1 C58.1 C59.1 D10.2(K) D11.2(K) IC5.4(V-) IC5.5(V-) IC5.12(V-) IC5.13(V-) IC6.2(GND1_1) IC6.8(GND1_2) IC7.3(ANODE) IC8.2(GND1_1) IC8.8(GND1_2) IC9.2(A) IC10.4(V-) R31.1 R32.2 R33.2 R34.2 R41.2 R42.2 R43.2
GND_MCU: C43.1 C44.1 C48.1 C49.1 IC6.9(GND2_1) IC6.15(GND2_2) IC8.9(GND2_1) IC8.15(GND2_2)
VBIAS_1: IC5.8(+) IC5.9(+) IC7.1(CATHODE) R24.1 R28.2
VBIAS_2: C54.1 C56.1 IC9.1(K) R40.1 R48.1 R53.1
NetC38_1: C38.1 IC5.16(OUTPUT_A) R23.1 R35.2 ; port EXC-
NetC38_2: C38.2 IC5.10(-) R30.1
NetC39_1: C39.1 ; port SPWM
NetC39_2: C39.2 R29.2
NetC40_1: C40.1 R23.2 R29.1 R30.2
NetC45_1: C45.1 IC5.2(OUTPUT_B) R36.1 ; port EXC+
NetC45_2: C45.2 IC5.7(-) R35.1 R36.2
NetC53_1: C53.1 D10.3(K/A) IC10.1(OUTPUT_1) R44.1 ; port SIN_OUT
NetC53_2: C53.2 IC10.2(-) R44.2 R45.1
NetC54_2: C54.2 IC10.3(+) R47.1 R48.2
NetC55_1: C55.1 D11.3(K/A) IC10.7(OUTPUT_2) R49.1 ; port COS_OUT
NetC55_2: C55.2 IC10.6(-) R49.2 R50.1
NetC56_2: C56.2 IC10.5(+) R52.1 R53.2
NetIC6_3: IC6.3(INA) R25.2 R32.1 ; port HALL_A
NetIC6_4: IC6.4(INB) R26.2 R33.1 ; port HALL_B
NetIC6_5: IC6.5(INC) R27.2 R34.1 ; port HALL_C
NetIC6_12: IC6.12(OUTC) ; port HALL_C_MCU
NetIC6_13: IC6.13(OUTB) ; port HALL_B_MCU
NetIC6_14: IC6.14(OUTA) ; port HALL_A_MCU
NetIC7_2: IC7.2(REF) R28.1 R31.2
NetIC8_3: IC8.3(INA) R37.2 R41.1 ; port ENC_A
NetIC8_4: IC8.4(INB) R38.2 R42.1 ; port ENC_B
NetIC8_5: IC8.5(INC) R39.2 R43.1 ; port ENC_Z
NetIC8_12: IC8.12(OUTC) ; port ENC_Z_MCU
NetIC8_13: IC8.13(OUTB) ; port ENC_B_MCU
NetIC8_14: IC8.14(OUTA) ; port ENC_A_MCU
NetJ5_28: R45.2 R46.2 ; port SIN+
NetJ5_29: R46.1 R47.2 ; port SIN-
NetJ5_30: R50.2 R51.2 ; port COS+
NetJ5_31: R51.1 R52.2 ; port COS-

Not connected (* = marked no-connect by the designer): IC5 3(NC_1)* 6(NC_2)* 11(NC_3)* 14(NC_4)* 15(NC_5)*; IC6 6(NC_1)* 7(NC_2)* 11(NC_3)*; IC8 6(NC_1)* 7(NC_2)* 11(NC_3)*; IC9 3(NC)*

### Library data of the parts
C38-C59 = CAP: SMD Chip Capacitor
D10 D11 = BAT54SH-TP: Schottky Diode; Manufacturer_Name: MCC; Datasheet Link: https://www.mccsemi.com/pdf/Products/BAT54H-BAT54SH(SOT-23).pdf; Height: 1.25mm; Manufacturer_Part_Number: BAT54SH-TP
IC5 = TCA0372BDWR2G: Integrated Circuit; Manufacturer_Name: onsemi; Datasheet Link: https://www.onsemi.com/pub/Collateral/TCA0372-D.PDF; Height: 2.65mm; Manufacturer_Part_Number: TCA0372BDWR2G; Mouser Part Number: 863-TCA0372BDWR2G; Mouser Price/Stock: https://www.mouser.co.uk/ProductDetail/onsemi/TCA0372BDWR2G?qs=xZq1yRCsb1cabHbnO0INRw%3D%3D; Arrow Part Number: TCA0372BDWR2G; Arrow Price/Stock: https://www.arrow.com/en/products/tca0372bdwr2g/on-semiconductor?region=nac
IC6 IC8 = ISO7330CDW: Integrated Circuit; Manufacturer_Name: Texas Instruments; Datasheet Link: http://www.ti.com/lit/gpn/iso7330c; Height: 2.65mm; Manufacturer_Part_Number: ISO7330CDW; Mouser Part Number: 595-ISO7330CDW; Mouser Price/Stock: https://www.mouser.co.uk/ProductDetail/Texas-Instruments/ISO7330CDW/?qs=OfeFRKQgECgkB7bvj%252B895A%3D%3D; Arrow Part Number: ISO7330CDW; Arrow Price/Stock: https://www.arrow.com/en/products/iso7330cdw/texas-instruments
IC7 = TL431CDBZR: Integrated Circuit; Manufacturer_Name: Texas Instruments; Datasheet Link: https://www.ti.com/lit/gpn/TL431; Height: 1.12mm; Manufacturer_Part_Number: TL431CDBZR; Mouser Part Number: 595-TL431CDBZR; Mouser Price/Stock: https://www.mouser.co.uk/ProductDetail/Texas-Instruments/TL431CDBZR?qs=odmYgEirbwwSWqcYApoxbg%3D%3D; Arrow Part Number: TL431CDBZR; Arrow Price/Stock: https://www.arrow.com/en/products/tl431cdbzr/texas-instruments?region=nac
IC9 = LM4040EIM3X-2.5_NOPB: Integrated Circuit; Manufacturer_Name: Texas Instruments; Manufacturer_Part_Number: LM4040EIM3X-2.5/NOPB; Datasheet Link: http://www.ti.com/lit/gpn/lm4040-n; Height: 1.12mm; Mouser Part Number: 926-LM4040EIM3X25NPB; Mouser Price/Stock: https://www.mouser.co.uk/ProductDetail/Texas-Instruments/LM4040EIM3X-2.5-NOPB?qs=QbsRYf82W3ECmAFJZbZXfA%3D%3D; Arrow Part Number: LM4040EIM3X-2.5/NOPB; Arrow Price/Stock: https://www.arrow.com/en/products/lm4040eim3x-2.5nopb/texas-instruments?region=nac
IC10 = MC33202DMR2G: Integrated Circuit; Manufacturer_Name: onsemi; Datasheet Link: https://www.onsemi.com/pub/Collateral/MC33201-D.PDF; Height: 1.1mm; Manufacturer_Part_Number: MC33202DMR2G; Mouser Part Number: 863-MC33202DMR2G; Mouser Price/Stock: https://www.mouser.co.uk/ProductDetail/onsemi/MC33202DMR2G?qs=dFKnUM%2FquJa76cgLejLdnw%3D%3D; Arrow Part Number: MC33202DMR2G; Arrow Price/Stock: https://www.arrow.com/en/products/mc33202dmr2g/on-semiconductor?region=nac
R23-R53 = RES: SMD Chip Resistor

## Sheet AD_Converter.SchDoc
size A3; SheetNumber: 8; SheetTotal: 16
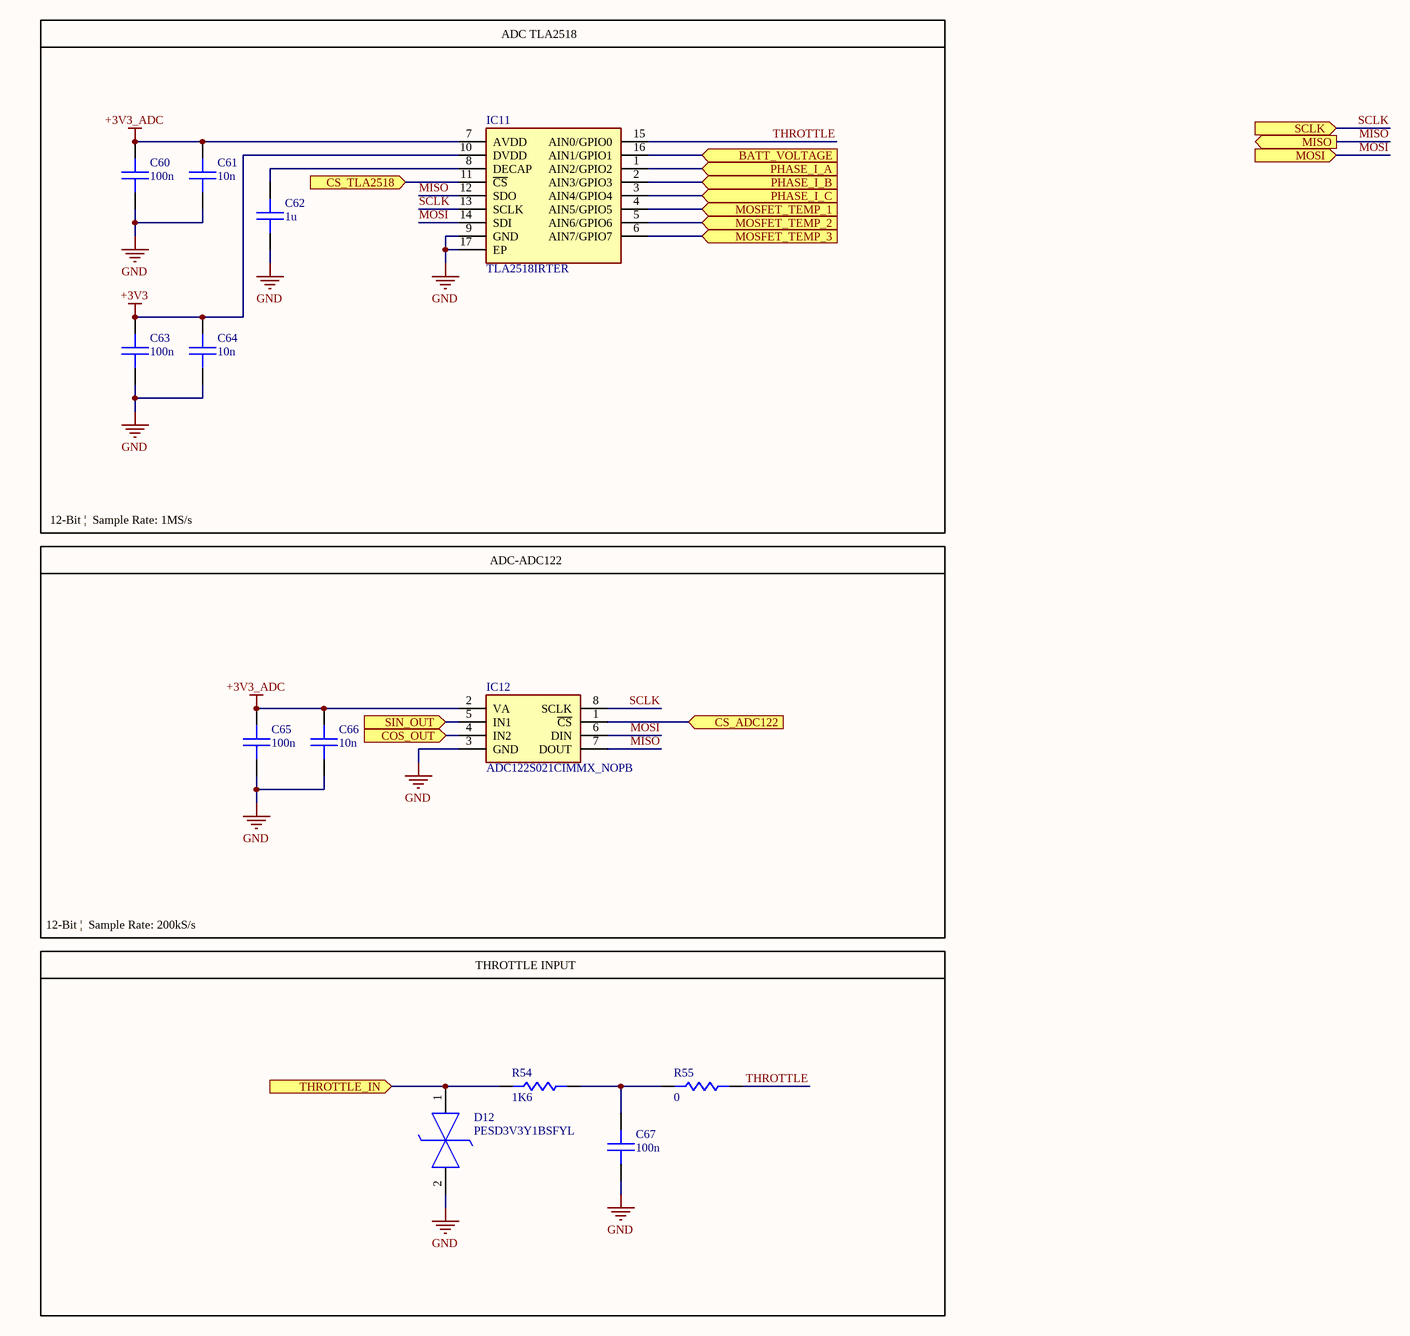
[diagram p8: AD_Converter.SchDoc]

### Parts
C60  100n  [C_0603]
C61  10n  [C_0603]
C62  1u  [C_0603]
C63  100n  [C_0603]
C64  10n  [C_0603]
C65  100n  [C_0603]
C66  10n  [C_0603]
C67  100n  [C_0603]
D12  PESD3V3Y1BSFYL  [PMEG3005AESFYL]
IC11  TLA2518IRTER  [QFN50P300X300X80-17N-D]
IC12  ADC122S021CIMMX_NOPB  [SOP65P490X110-8N]
R54  1K6  [R_0603]
R55  0  [R_0603]

### Blocks framed on the sheet
THROTTLE INPUT: C67 D12 R54 R55

### Ports
BATT_VOLTAGE (in, see Interconnections[2B], Headers[1A]), COS_OUT (in, see Interconnections[3B], Feedback_Sensors[3C]), CS_ADC122 (in, see Interconnections[3B], IO_Expander[3A]), CS_TLA2518 (in, see Interconnections[3B], IO_Expander[3A]), MISO (out, see Interconnections[3C], Isolator_Spi[2A]), MOSFET_TEMP_1 (in, see Interconnections[2C], Headers[1B]), MOSFET_TEMP_2 (in, see Interconnections[2C], Headers[1B]), MOSFET_TEMP_3 (in, see Interconnections[2C], Headers[1B]), MOSI (in, see Interconnections[3C], Isolator_Spi[2A]), PHASE_I_A (in, see Interconnections[2B], Headers[1A]), PHASE_I_B (in, see Interconnections[2C], Headers[1A]), PHASE_I_C (in, see Interconnections[2C], Headers[2A]), SCLK (in, see Interconnections[3C], Isolator_Spi[2A]), SIN_OUT (in, see Interconnections[3B], Feedback_Sensors[3C]), THROTTLE_IN (in, see Interconnections[2B], Main_Connector[1B])

### Nets
+3V3: C63.2 C64.2 IC11.10(DVDD)
+3V3_ADC: C60.2 C61.2 C65.2 C66.2 IC11.7(AVDD) IC12.2(VA)
GND: C60.1 C61.1 C62.1 C63.1 C64.1 C65.1 C66.1 C67.1 D12.2(K2) IC11.9(GND) IC11.17(EP) IC12.3(GND)
MISO: IC11.12(SDO) IC12.7(DOUT) ; port MISO
MOSI: IC11.14(SDI) IC12.6(DIN) ; port MOSI
SCLK: IC11.13(SCLK) IC12.8(SCLK) ; port SCLK
THROTTLE: IC11.15(AIN0/GPIO0) R55.1
NetC53_1: IC12.5(IN1) ; port SIN_OUT
NetC55_1: IC12.4(IN2) ; port COS_OUT
NetC62_2: C62.2 IC11.8(DECAP)
NetC67_2: C67.2 R54.1 R55.2
NetD12_1: D12.1(K1) R54.2 ; port THROTTLE_IN
NetIC3_8: IC11.11(~{CS}) ; port CS_TLA2518
NetIC3_10: IC12.1(~{CS}) ; port CS_ADC122
NetIC11_1: IC11.1(AIN2/GPIO2) ; port PHASE_I_A
NetIC11_2: IC11.2(AIN3/GPIO3) ; port PHASE_I_B
NetIC11_3: IC11.3(AIN4/GPIO4) ; port PHASE_I_C
NetIC11_4: IC11.4(AIN5/GPIO5) ; port MOSFET_TEMP_1
NetIC11_5: IC11.5(AIN6/GPIO6) ; port MOSFET_TEMP_2
NetIC11_6: IC11.6(AIN7/GPIO7) ; port MOSFET_TEMP_3
NetIC11_16: IC11.16(AIN1/GPIO1) ; port BATT_VOLTAGE

### Notes on the sheet
- ADC TLA2518
- 12-Bit |  Sample Rate: 1MS/s
- ADC-ADC122
- 12-Bit |  Sample Rate: 200kS/s

### Library data of the parts
C60-C67 = CAP: SMD Chip Capacitor
D12 = PESD3V3Y1BSFYL: as D6 on sheet IO_Expander; Datasheet Link: https://assets.nexperia.com/documents/data-sheet/PESD3V3Y1BSF.pdf; Manufacturer_Part_Number: PESD3V3Y1BSFYL; Mouser Part Number: 771-PESD3V3Y1BSFYL; Mouser Price/Stock: https://www.mouser.co.uk/ProductDetail/Nexperia/PESD3V3Y1BSFYL?qs=MLItCLRbWswJ%2F2jJIhlIxQ%3D%3D; Arrow Part Number: PESD3V3Y1BSFYL; Arrow Price/Stock: https://www.arrow.com/en/products/pesd3v3y1bsfyl/nexperia?region=asia
IC11 = TLA2518IRTER: Integrated Circuit; Manufacturer_Name: Texas Instruments; Datasheet Link: http://www.ti.com/lit/ds/symlink/tla2518.pdf; Height: 0.8mm; Manufacturer_Part_Number: TLA2518IRTER; Mouser Part Number: 595-TLA2518IRTER; Mouser Price/Stock: https://www.mouser.co.uk/ProductDetail/Texas-Instruments/TLA2518IRTER?qs=XeJtXLiO41Rx1uJi657ctQ%3D%3D; Arrow Part Number: TLA2518IRTER; Arrow Price/Stock: https://www.arrow.com/en/products/tla2518irter/texas-instruments?region=europe
IC12 = ADC122S021CIMMX_NOPB: Integrated Circuit; Manufacturer_Name: Texas Instruments; Manufacturer_Part_Number: ADC122S021CIMMX/NOPB; Datasheet Link: http://www.ti.com/lit/gpn/ADC122S021; Height: 1.1mm; Mouser Part Number: 926-A122S021CIMMXNPB; Mouser Price/Stock: https://www.mouser.co.uk/ProductDetail/Texas-Instruments/ADC122S021CIMMX-NOPB/?qs=7X5t%252BdzoRHB2bC7Teu8H3A%3D%3D; Arrow Part Number: ADC122S021CIMMX/NOPB; Arrow Price/Stock: https://www.arrow.com/en/products/adc122s021cimmxnopb/texas-instruments
R54 R55 = RES: SMD Chip Resistor

## Sheet Gate_Drivers.SchDoc
size A3; SheetNumber: 9; SheetTotal: 16
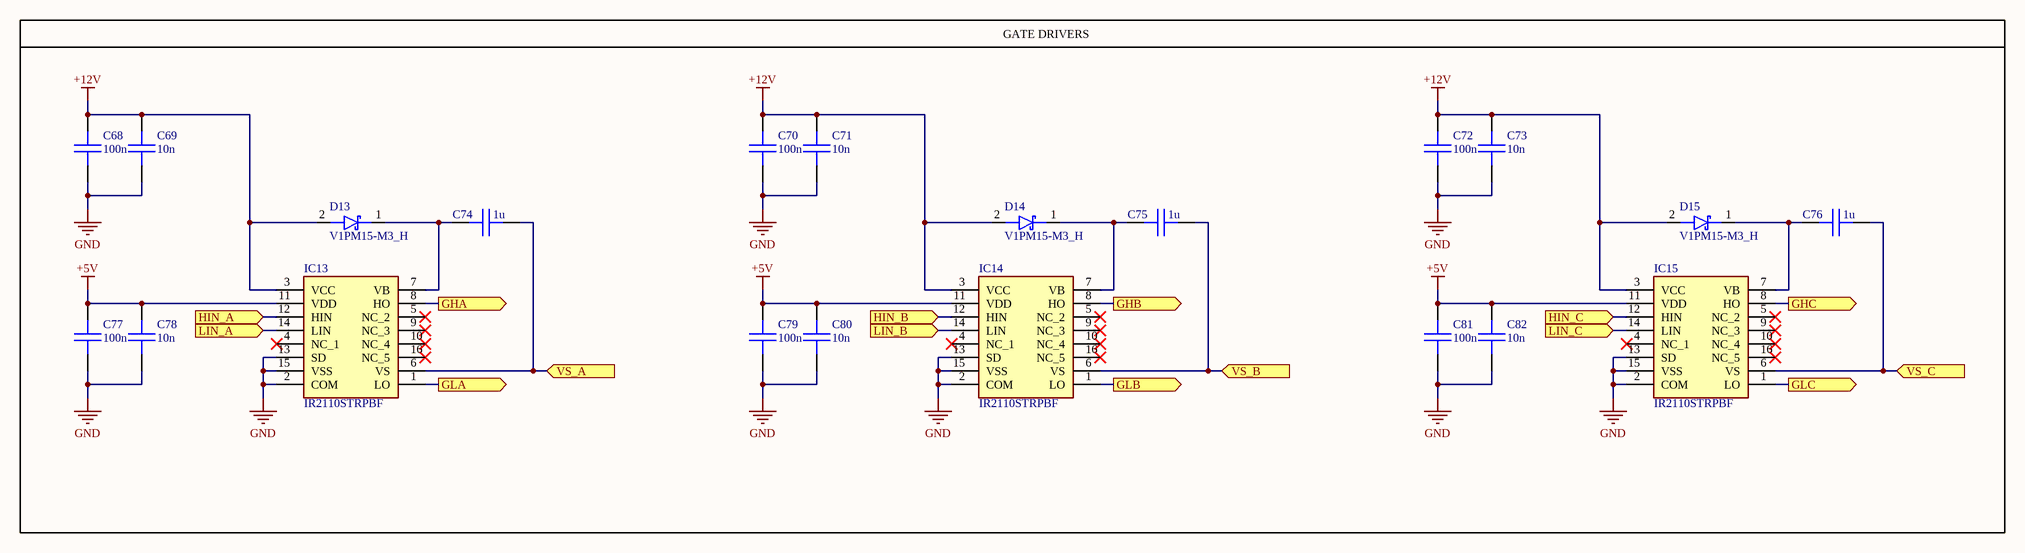
[diagram p9: Gate_Drivers.SchDoc]

### Parts
C68  100n  [C_0603]
C69  10n  [C_0603]
C70  100n  [C_0603]
C71  10n  [C_0603]
C72  100n  [C_0603]
C73  10n  [C_0603]
C74  1u  [C_0805]
C75  1u  [C_0805]
C76  1u  [C_0805]
C77  100n  [C_0603]
C78  10n  [C_0603]
C79  100n  [C_0603]
C80  10n  [C_0603]
C81  100n  [C_0603]
C82  10n  [C_0603]
D13  V1PM15-M3_H  [DO-219AD-2]
D14  V1PM15-M3_H  [DO-219AD-2]
D15  V1PM15-M3_H  [DO-219AD-2]
IC13  IR2110STRPBF  [SOIC127P1032X265-16N]
IC14  IR2110STRPBF  [SOIC127P1032X265-16N]
IC15  IR2110STRPBF  [SOIC127P1032X265-16N]

### Blocks framed on the sheet
GATE DRIVERS: C68-C82 D13-D15 IC13-IC15

### Ports
GHA (out, see Interconnections[2C], Headers[1B]), GHB (out, see Interconnections[2C], Headers[1B]), GHC (out, see Interconnections[2C], Headers[2B]), GLA (out, see Interconnections[2C], Headers[1B]), GLB (out, see Interconnections[2C], Headers[2B]), GLC (out, see Interconnections[2C], Headers[2B]), HIN_A (in, see Interconnections[3C], Isolator_Gate_Driver[2A]), HIN_B (in, see Interconnections[3C], Isolator_Gate_Driver[2A]), HIN_C (in, see Interconnections[3C], Isolator_Gate_Driver[2A]), LIN_A (in, see Interconnections[3C], Isolator_Gate_Driver[2A]), LIN_B (in, see Interconnections[3C], Isolator_Gate_Driver[2A]), LIN_C (in, see Interconnections[3C], Isolator_Gate_Driver[2A]), VS_A (in, see Interconnections[2C], Headers[1C]), VS_B (in, see Interconnections[2C], Headers[1C]), VS_C (in, see Interconnections[2C], Headers[1C])

### Nets
+5V: C77.2 C78.2 C79.2 C80.2 C81.2 C82.2 IC13.11(VDD) IC14.11(VDD) IC15.11(VDD)
+12V: C68.2 C69.2 C70.2 C71.2 C72.2 C73.2 D13.2(A) D14.2(A) D15.2(A) IC13.3(VCC) IC14.3(VCC) IC15.3(VCC)
GND: C68.1 C69.1 C70.1 C71.1 C72.1 C73.1 C77.1 C78.1 C79.1 C80.1 C81.1 C82.1 IC13.2(COM) IC13.13(SD) IC13.15(VSS) IC14.2(COM) IC14.13(SD) IC14.15(VSS) IC15.2(COM) IC15.13(SD) IC15.15(VSS)
NetC74_1: C74.1 IC13.6(VS) ; port VS_A
NetC74_2: C74.2 D13.1(K) IC13.7(VB)
NetC75_1: C75.1 IC14.6(VS) ; port VS_B
NetC75_2: C75.2 D14.1(K) IC14.7(VB)
NetC76_1: C76.1 IC15.6(VS) ; port VS_C
NetC76_2: C76.2 D15.1(K) IC15.7(VB)
NetIC13_1: IC13.1(LO) ; port GLA
NetIC13_8: IC13.8(HO) ; port GHA
NetIC13_12: IC13.12(HIN) ; port HIN_A
NetIC13_14: IC13.14(LIN) ; port LIN_A
NetIC14_1: IC14.1(LO) ; port GLB
NetIC14_8: IC14.8(HO) ; port GHB
NetIC14_12: IC14.12(HIN) ; port HIN_B
NetIC14_14: IC14.14(LIN) ; port LIN_B
NetIC15_1: IC15.1(LO) ; port GLC
NetIC15_8: IC15.8(HO) ; port GHC
NetIC15_12: IC15.12(HIN) ; port HIN_C
NetIC15_14: IC15.14(LIN) ; port LIN_C

Not connected (* = marked no-connect by the designer): IC13 4(NC_1)* 5(NC_2)* 9(NC_3)* 10(NC_4)* 16(NC_5)*; IC14 4(NC_1)* 5(NC_2)* 9(NC_3)* 10(NC_4)* 16(NC_5)*; IC15 4(NC_1)* 5(NC_2)* 9(NC_3)* 10(NC_4)* 16(NC_5)*

### Library data of the parts
C68-C82 = CAP: SMD Chip Capacitor
D13-D15 = DIODE_SCHOTTKY_V1PM15-M3_H: Schottky Diode, 150V, 1A, Vf: 1.13V; Vf: 1.3V; ComponentLink1Description: New link; ComponentLink1URL: https://www.mouser.com.tr/ProductDetail/Vishay-General-Semiconductor/V1PM15-M3-H?qs=%252BdQmOuGyFcHNPmRG94B76g%3D%3D; Vrm: 150V; If: 1A
IC13-IC15 = IR2110STRPBF: Integrated Circuit; Manufacturer_Name: Infineon; Datasheet Link: https://www.infineon.com/cms/en/product/power/gate-driver-ics/?; Height: 2.65mm; Manufacturer_Part_Number: IR2110STRPBF; Mouser Part Number: 942-IR2110STRPBF; Mouser Price/Stock: https://www.mouser.co.uk/ProductDetail/Infineon-Technologies/IR2110STRPBF?qs=2r01AXMCG3P4pNuJUqFzxg%3D%3D; Arrow Part Number: IR2110STRPBF; Arrow Price/Stock: https://www.arrow.com/en/products/ir2110strpbf/infineon-technologies-ag?utm_currency=USD&region=nac

## Sheet Isolator_Gate_Driver.SchDoc
size A4; SheetNumber: 10; SheetTotal: 16
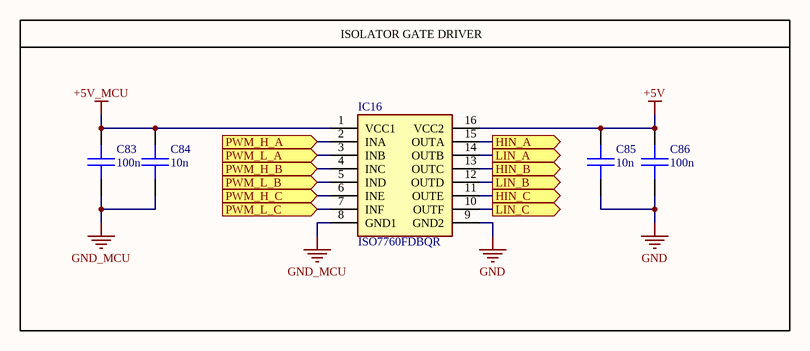
[diagram p10: Isolator_Gate_Driver.SchDoc]

### Parts
C83  100n  [C_0603]
C84  10n  [C_0603]
C85  10n  [C_0603]
C86  100n  [C_0603]
IC16  ISO7760FDBQR  [SOP64P600X175-16N]

### Blocks framed on the sheet
ISOLATOR GATE DRIVER: C83-C86 IC16

### Ports
HIN_A (out, see Interconnections[4C], Gate_Drivers[1A]), HIN_B (out, see Interconnections[4C], Gate_Drivers[4A]), HIN_C (out, see Interconnections[4C], Gate_Drivers[6A]), LIN_A (out, see Interconnections[4C], Gate_Drivers[1A]), LIN_B (out, see Interconnections[4C], Gate_Drivers[4A]), LIN_C (out, see Interconnections[4C], Gate_Drivers[6A]), PWM_H_A (in, see Interconnections[5C], Microcontroller[4B]), PWM_H_B (in, see Interconnections[5C], Microcontroller[4B]), PWM_H_C (in, see Interconnections[5C], Microcontroller[4B]), PWM_L_A (in, see Interconnections[5C], Microcontroller[4B]), PWM_L_B (in, see Interconnections[5C], Microcontroller[4B]), PWM_L_C (in, see Interconnections[5C], Microcontroller[4B])

### Nets
+5V: C85.2 C86.2 IC16.16(VCC2)
+5V_MCU: C83.2 C84.2 IC16.1(VCC1)
GND: C85.1 C86.1 IC16.9(GND2)
GND_MCU: C83.1 C84.1 IC16.8(GND1)
NetIC13_12: IC16.15(OUTA) ; port HIN_A
NetIC13_14: IC16.14(OUTB) ; port LIN_A
NetIC14_12: IC16.13(OUTC) ; port HIN_B
NetIC14_14: IC16.12(OUTD) ; port LIN_B
NetIC15_12: IC16.11(OUTE) ; port HIN_C
NetIC15_14: IC16.10(OUTF) ; port LIN_C
NetIC16_2: IC16.2(INA) ; port PWM_H_A
NetIC16_3: IC16.3(INB) ; port PWM_L_A
NetIC16_4: IC16.4(INC) ; port PWM_H_B
NetIC16_5: IC16.5(IND) ; port PWM_L_B
NetIC16_6: IC16.6(INE) ; port PWM_H_C
NetIC16_7: IC16.7(INF) ; port PWM_L_C

### Library data of the parts
C83-C86 = CAP: SMD Chip Capacitor
IC16 = ISO7760FDBQR: Integrated Circuit; Manufacturer_Name: Texas Instruments; Datasheet Link: https://www.ti.com/lit/ds/symlink/iso7760.pdf?ts=1635771024326&ref_url=https%253A%252F%252Fwww.ti.com%252Fproduct%252FISO7760; Height: 1.75mm; Manufacturer_Part_Number: ISO7760FDBQR; Mouser Part Number: 595-ISO7760FDBQR; Mouser Price/Stock: https://www.mouser.co.uk/ProductDetail/Texas-Instruments/ISO7760FDBQR?qs=rrS6PyfT74eAAfpmQeXWaw%3D%3D; Arrow Part Number: ISO7760FDBQR; Arrow Price/Stock: https://www.arrow.com/en/products/iso7760fdbqr/texas-instruments?region=nac

## Sheet Headers.SchDoc
size A4; SheetNumber: 11; SheetTotal: 16
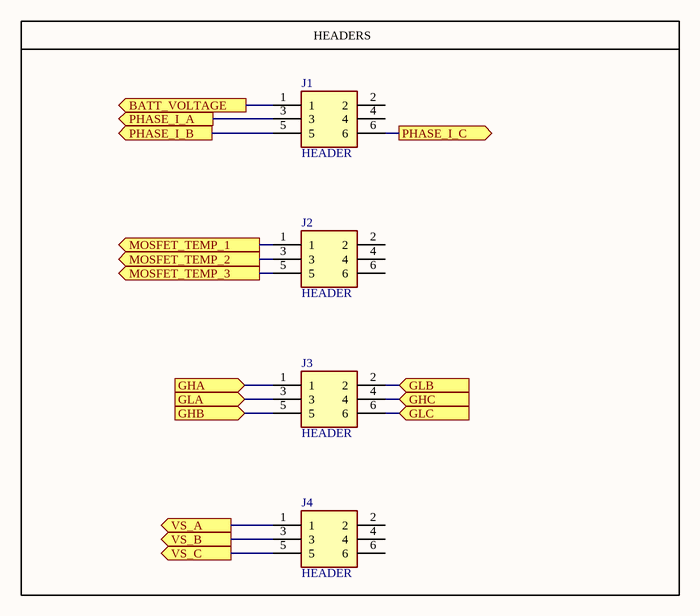
[diagram p11: Headers.SchDoc]

### Parts
J1  HEADER  [HEADER_FEMALE_SMD_2X3_1.27MM]
J2  HEADER  [HEADER_FEMALE_SMD_2X3_1.27MM]
J3  HEADER  [HEADER_FEMALE_SMD_2X3_1.27MM]
J4  HEADER  [HEADER_FEMALE_SMD_2X3_1.27MM]

### Blocks framed on the sheet
HEADERS: J1-J4

### Ports
BATT_VOLTAGE (out, see Interconnections[2B], AD_Converter[3A]), GHA (in, see Interconnections[2C], Gate_Drivers[2A]), GHB (in, see Interconnections[2C], Gate_Drivers[5A]), GHC (in, see Interconnections[2C], Gate_Drivers[7A]), GLA (in, see Interconnections[2C], Gate_Drivers[2B]), GLB (in, see Interconnections[2C], Gate_Drivers[5B]), GLC (in, see Interconnections[2C], Gate_Drivers[7B]), MOSFET_TEMP_1 (out, see Interconnections[2C], AD_Converter[3A]), MOSFET_TEMP_2 (out, see Interconnections[2C], AD_Converter[3A]), MOSFET_TEMP_3 (out, see Interconnections[2C], AD_Converter[3A]), PHASE_I_A (out, see Interconnections[2B], AD_Converter[3A]), PHASE_I_B (out, see Interconnections[2C], AD_Converter[3A]), PHASE_I_C (out, see Interconnections[2C], AD_Converter[3A]), VS_A (out, see Interconnections[2C], Gate_Drivers[3B]), VS_B (out, see Interconnections[2C], Gate_Drivers[5B]), VS_C (out, see Interconnections[2C], Gate_Drivers[8B])

### Nets
NetC74_1: J4.1 ; port VS_A
NetC75_1: J4.3 ; port VS_B
NetC76_1: J4.5 ; port VS_C
NetIC11_1: J1.3 ; port PHASE_I_A
NetIC11_2: J1.5 ; port PHASE_I_B
NetIC11_3: J1.6 ; port PHASE_I_C
NetIC11_4: J2.1 ; port MOSFET_TEMP_1
NetIC11_5: J2.3 ; port MOSFET_TEMP_2
NetIC11_6: J2.5 ; port MOSFET_TEMP_3
NetIC11_16: J1.1 ; port BATT_VOLTAGE
NetIC13_1: J3.3 ; port GLA
NetIC13_8: J3.1 ; port GHA
NetIC14_1: J3.2 ; port GLB
NetIC14_8: J3.5 ; port GHB
NetIC15_1: J3.6 ; port GLC
NetIC15_8: J3.4 ; port GHC

Not connected (* = marked no-connect by the designer): J1 2 4; J2 2 4 6; J4 2 4 6

### Library data of the parts
J1-J4 = HEADER_SMD_2X3_1.27MM

## Sheet Main_Connector.SchDoc
size A4; SheetNumber: 12; SheetTotal: 16
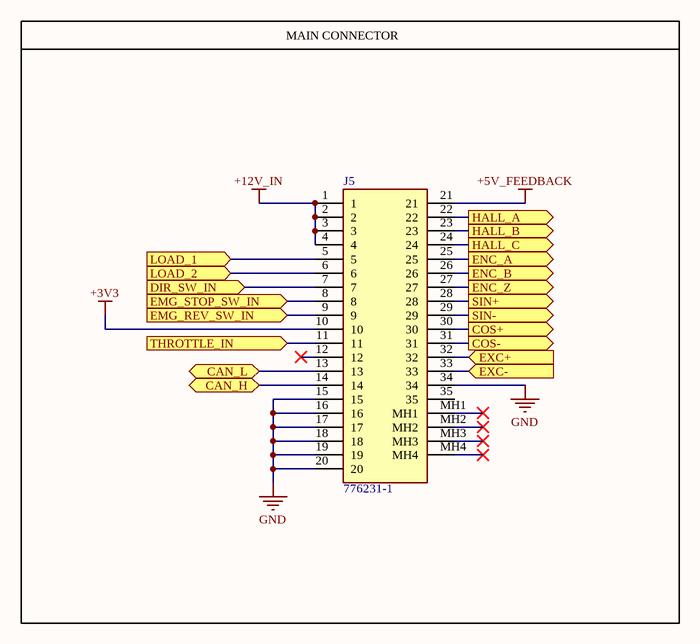
[diagram p12: Main_Connector.SchDoc]

### Parts
J5  776231-1  [7762311]

### Blocks framed on the sheet
MAIN CONNECTOR: J5

### Ports
CAN_H (bidir, see Interconnections[2B], Communications[2A]), CAN_L (bidir, see Interconnections[2B], Communications[2A]), COS+ (out, see Interconnections[2B], Feedback_Sensors[1C]), COS- (out, see Interconnections[2B], Feedback_Sensors[1D]), DIR_SW_IN (in, see Interconnections[2A], IO_Expander[2B]), EMG_REV_SW_IN (in, see Interconnections[2A], IO_Expander[1D]), EMG_STOP_SW_IN (in, see Interconnections[2A], IO_Expander[1C]), ENC_A (out, see Interconnections[2B], Feedback_Sensors[5B]), ENC_B (out, see Interconnections[2B], Feedback_Sensors[5B]), ENC_Z (out, see Interconnections[2B], Feedback_Sensors[5B]), EXC+ (in, see Interconnections[2B], Feedback_Sensors[2A]), EXC- (in, see Interconnections[2B], Feedback_Sensors[3A]), HALL_A (out, see Interconnections[2B], Feedback_Sensors[5A]), HALL_B (out, see Interconnections[2B], Feedback_Sensors[5A]), HALL_C (out, see Interconnections[2B], Feedback_Sensors[5A]), LOAD_1 (in, see Interconnections[2A], Load_Switches[5A]), LOAD_2 (in, see Interconnections[2A], Load_Switches[5B]), SIN+ (out, see Interconnections[2B], Feedback_Sensors[1C]), SIN- (out, see Interconnections[2B], Feedback_Sensors[1C]), THROTTLE_IN (in, see Interconnections[2B], AD_Converter[2C])

### Nets
+3V3: J5.10
+5V_FEEDBACK: J5.21
+12V_IN: J5.1 J5.2 J5.3 J5.4
GND: J5.15 J5.16 J5.17 J5.18 J5.19 J5.20 J5.34
NetC31_1: J5.7 ; port DIR_SW_IN
NetC32_1: J5.8 ; port EMG_STOP_SW_IN
NetC33_1: J5.9 ; port EMG_REV_SW_IN
NetC38_1: J5.33 ; port EXC-
NetC45_1: J5.32 ; port EXC+
NetD2_2: J5.5 ; port LOAD_1
NetD4_2: J5.6 ; port LOAD_2
NetD9_1: J5.14 ; port CAN_H
NetD9_2: J5.13 ; port CAN_L
NetD12_1: J5.11 ; port THROTTLE_IN
NetIC6_3: J5.22 ; port HALL_A
NetIC6_4: J5.23 ; port HALL_B
NetIC6_5: J5.24 ; port HALL_C
NetIC8_3: J5.25 ; port ENC_A
NetIC8_4: J5.26 ; port ENC_B
NetIC8_5: J5.27 ; port ENC_Z
NetJ5_28: J5.28 ; port SIN+
NetJ5_29: J5.29 ; port SIN-
NetJ5_30: J5.30 ; port COS+
NetJ5_31: J5.31 ; port COS-

Not connected (* = marked no-connect by the designer): J5 12* 35 MH1* MH2* MH3* MH4*

### Library data of the parts
J5 = 776231-1: Connector; Manufacturer_Name: TE Connectivity; Datasheet Link: https://www.te.com/commerce/DocumentDelivery/DDEController?Action=srchrtrv&DocNm=1-1773979-2&DocType=Data%20Sheet&DocLang=English&PartCntxt=776231-1&DocFormat=pdf; Height: 34.25mm; Manufacturer_Part_Number: 776231-1; Mouser Part Number: 571-776231-1; Mouser Price/Stock: https://www.mouser.co.uk/ProductDetail/TE-Connectivity/776231-1?qs=YqNA2qefETAQAJm2ankyIA%3D%3D; Arrow Part Number: 776231-1; Arrow Price/Stock: https://www.arrow.com/en/products/776231-1/te-connectivity?region=nac

## Sheet Microcontroller.SchDoc
size A3; SheetNumber: 13; SheetTotal: 16
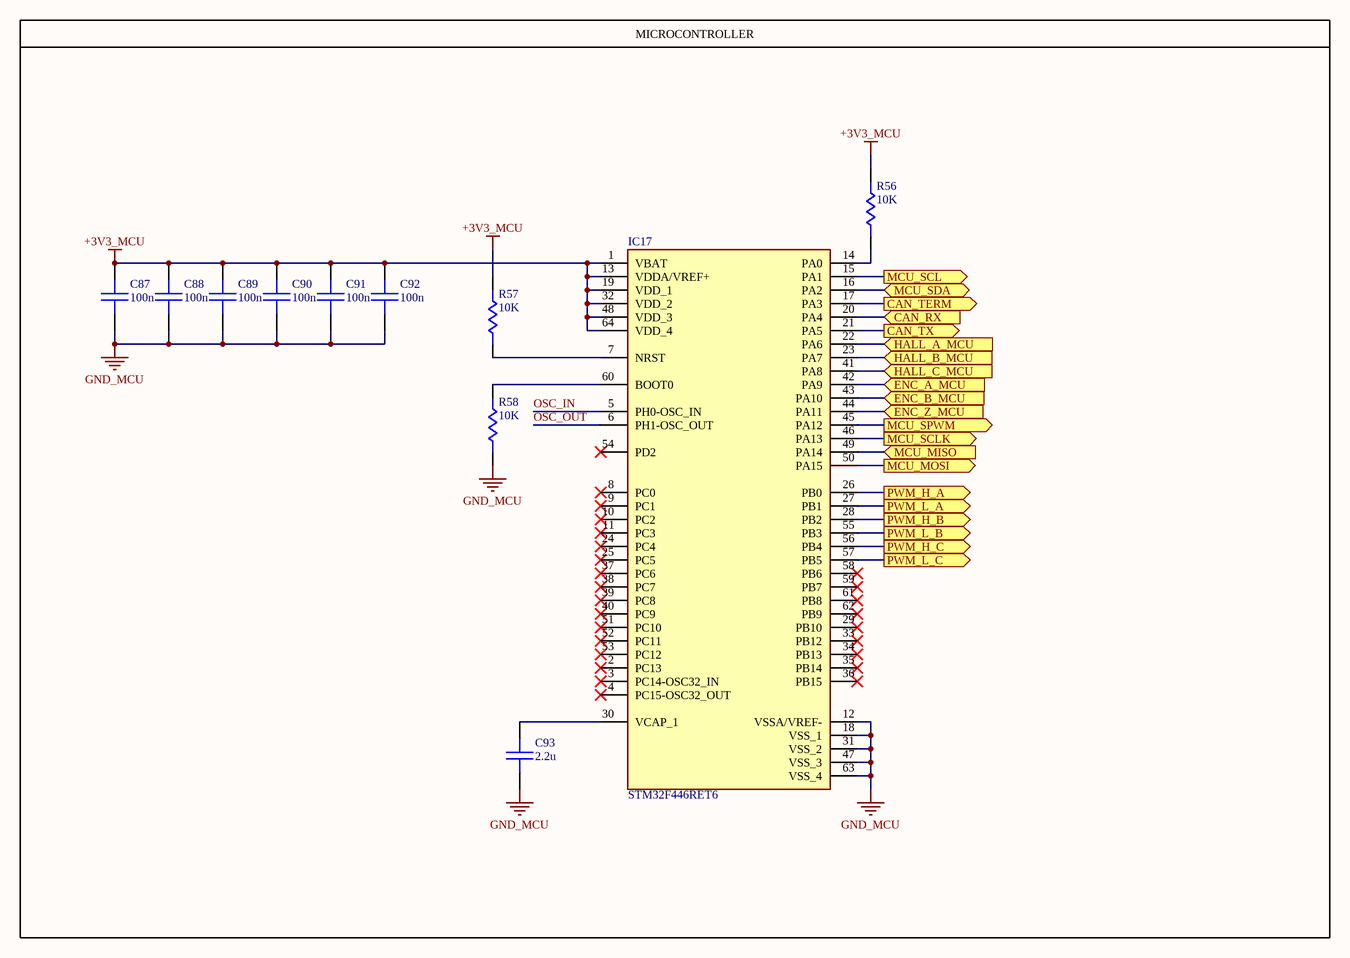
[diagram p13: Microcontroller.SchDoc]

### Parts
C87  100n  [C_0603]
C88  100n  [C_0603]
C89  100n  [C_0603]
C90  100n  [C_0603]
C91  100n  [C_0603]
C92  100n  [C_0603]
C93  2.2u  [C_0603]
IC17  STM32F446RET6  [QFP50P1200X1200X160-64N]
R56  10K  [R_0603]
R57  10K  [R_0603]
R58  10K  [R_0603]

### Blocks framed on the sheet
MICROCONTROLLER: C87-C93 IC17 R56-R58

### Ports
CAN_RX (in, see Interconnections[5B], Communications[1A]), CAN_TERM (out, see Interconnections[5B], Communications[1B]), CAN_TX (out, see Interconnections[5B], Communications[1A]), ENC_A_MCU (in, see Interconnections[5B], Feedback_Sensors[7B]), ENC_B_MCU (in, see Interconnections[5B], Feedback_Sensors[7B]), ENC_Z_MCU (in, see Interconnections[5B], Feedback_Sensors[7B]), HALL_A_MCU (in, see Interconnections[5B], Feedback_Sensors[7A]), HALL_B_MCU (in, see Interconnections[5B], Feedback_Sensors[7A]), HALL_C_MCU (in, see Interconnections[5B], Feedback_Sensors[7A]), MCU_MISO (in, see Interconnections[5C], Isolator_Spi[1A]), MCU_MOSI (out, see Interconnections[5C], Isolator_Spi[1A]), MCU_SCL (out, see Interconnections[5A], Isolator_I2C[1A]), MCU_SCLK (out, see Interconnections[5C], Isolator_Spi[1A]), MCU_SDA (bidir, see Interconnections[5A], Isolator_I2C[1A]), MCU_SPWM (out, see Interconnections[5B], Isolator_SPWM[1A]), PWM_H_A (out, see Interconnections[5C], Isolator_Gate_Driver[1A]), PWM_H_B (out, see Interconnections[5C], Isolator_Gate_Driver[1A]), PWM_H_C (out, see Interconnections[5C], Isolator_Gate_Driver[1A]), PWM_L_A (out, see Interconnections[5C], Isolator_Gate_Driver[1A]), PWM_L_B (out, see Interconnections[5C], Isolator_Gate_Driver[1A]), PWM_L_C (out, see Interconnections[5C], Isolator_Gate_Driver[1A])

### Nets
+3V3_MCU: C87.2 C88.2 C89.2 C90.2 C91.2 C92.2 IC17.1(VBAT) IC17.13(VDDA/VREF+) IC17.19(VDD_1) IC17.32(VDD_2) IC17.48(VDD_3) IC17.64(VDD_4) R56.1 R57.1
GND_MCU: C87.1 C88.1 C89.1 C90.1 C91.1 C92.1 C93.1 IC17.12(VSSA/VREF-) IC17.18(VSS_1) IC17.31(VSS_2) IC17.47(VSS_3) IC17.63(VSS_4) R58.2
OSC_IN: IC17.5(PH0-OSC_IN)
OSC_OUT: IC17.6(PH1-OSC_OUT)
NetC93_2: C93.2 IC17.30(VCAP_1)
NetIC4_2: IC17.20(PA4) ; port CAN_RX
NetIC4_3: IC17.21(PA5) ; port CAN_TX
NetIC6_12: IC17.41(PA8) ; port HALL_C_MCU
NetIC6_13: IC17.23(PA7) ; port HALL_B_MCU
NetIC6_14: IC17.22(PA6) ; port HALL_A_MCU
NetIC8_12: IC17.44(PA11) ; port ENC_Z_MCU
NetIC8_13: IC17.43(PA10) ; port ENC_B_MCU
NetIC8_14: IC17.42(PA9) ; port ENC_A_MCU
NetIC16_2: IC17.26(PB0) ; port PWM_H_A
NetIC16_3: IC17.27(PB1) ; port PWM_L_A
NetIC16_4: IC17.28(PB2) ; port PWM_H_B
NetIC16_5: IC17.55(PB3) ; port PWM_L_B
NetIC16_6: IC17.56(PB4) ; port PWM_H_C
NetIC16_7: IC17.57(PB5) ; port PWM_L_C
NetIC17_7: IC17.7(NRST) R57.2
NetIC17_14: IC17.14(PA0) R56.2
NetIC17_15: IC17.15(PA1) ; port MCU_SCL
NetIC17_16: IC17.16(PA2) ; port MCU_SDA
NetIC17_17: IC17.17(PA3) ; port CAN_TERM
NetIC17_45: IC17.45(PA12) ; port MCU_SPWM
NetIC17_46: IC17.46(PA13) ; port MCU_SCLK
NetIC17_49: IC17.49(PA14) ; port MCU_MISO
NetIC17_50: IC17.50(PA15) ; port MCU_MOSI
NetIC17_60: IC17.60(BOOT0) R58.1

Not connected (* = marked no-connect by the designer): IC17 2(PC13)* 3(PC14-OSC32_IN)* 4(PC15-OSC32_OUT)* 8(PC0)* 9(PC1)* 10(PC2)* 11(PC3)* 24(PC4)* 25(PC5)* 29(PB10)* 33(PB12)* 34(PB13)* 35(PB14)* 36(PB15)* 37(PC6)* 38(PC7)* 39(PC8)* 40(PC9)* 51(PC10)* 52(PC11)* 53(PC12)* 54(PD2)* 58(PB6)* 59(PB7)* 61(PB8)* 62(PB9)*

### Library data of the parts
C87-C93 = CAP: SMD Chip Capacitor
IC17 = STM32F446RET6: Integrated Circuit; Manufacturer_Name: STMicroelectronics; Datasheet Link: https://datasheet.datasheetarchive.com/originals/distributors/DKDS41/DSANUWW0028583.pdf; Height: 1.6mm; Manufacturer_Part_Number: STM32F446RET6; Mouser Part Number: 511-STM32F446RET6; Mouser Price/Stock: https://www.mouser.co.uk/ProductDetail/STMicroelectronics/STM32F446RET6?qs=Ok1pvOkw6%2FqpQsWf8F4wtQ%3D%3D; Arrow Part Number: STM32F446RET6; Arrow Price/Stock: https://www.arrow.com/en/products/stm32f446ret6/stmicroelectronics?utm_currency=USD&region=nac
R56-R58 = RES: SMD Chip Resistor